# EAGLE design M868tqfp (EAGLE 6.6.0)
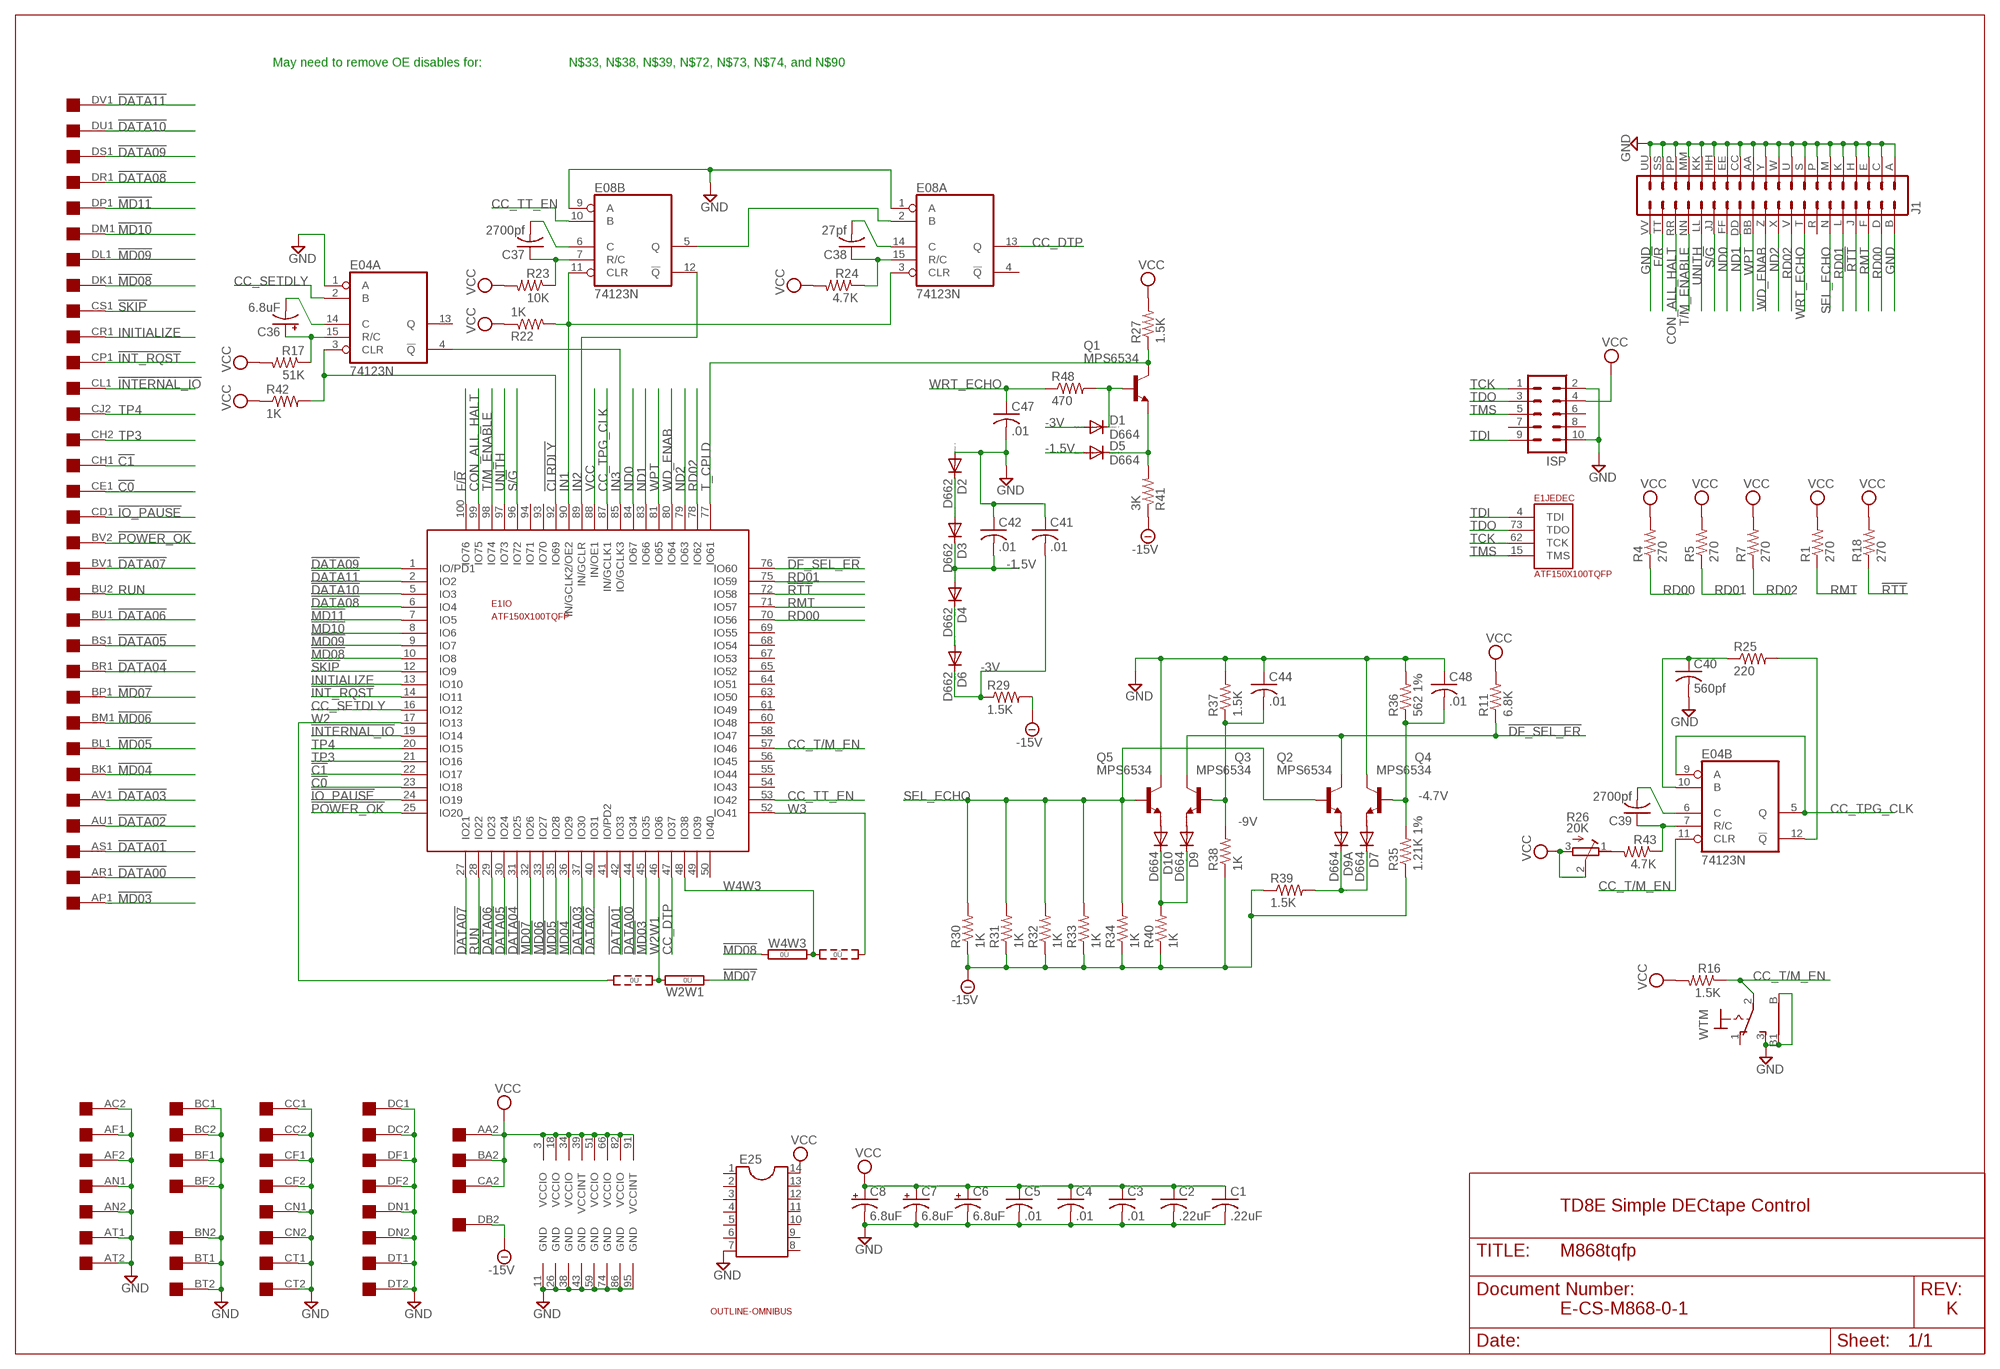
[diagram p0: schematic, sheet 1]

## Parts
C1  .22uF  C-US050-025X075  [C050-025X075]
C2  .22uF  C-US050-025X075  [C050-025X075]
C3  .01  C-US050-025X075  [C050-025X075]
C4  .01  C-US050-025X075  [C050-025X075]
C5  .01  C-US050-025X075  [C050-025X075]
C6  6.8uF  CPOL-USE20-8AXIAL  [E12-8]
C7  6.8uF  CPOL-USE20-8AXIAL  [E12-8]
C8  6.8uF  CPOL-USE20-8AXIAL  [E12-8]
C36  6.8uF  CPOL-USE20-8AXIAL  [E12-8]
C37  2700pf  C-US102-043X133  [C102-043X133]
C38  27pf  C-US050-025X075  [C050-025X075]
C39  2700pf  C-US102-043X133  [C102-043X133]
C40  560pf  C-US075-032X103  [C075-032X103]
C41  .01  C-US050-025X075  [C050-025X075]
C42  .01  C-US050-025X075  [C050-025X075]
C44  .01  C-US050-025X075  [C050-025X075]
C47  .01  C-US050-025X075  [C050-025X075]
C48  .01  C-US050-025X075  [C050-025X075]
D1  D664  1N4148DO35-10  [DO35-10]
D2  D662  1N4148DO35-10  [DO35-10]
D3  D662  1N4148DO35-10  [DO35-10]
D4  D662  1N4148DO35-10  [DO35-10]
D5  D664  1N4148DO35-10  [DO35-10]
D6  D662  1N4148DO35-10  [DO35-10]
D7  D664  1N4148DO35-10  [DO35-10]
D9  D664  1N4148DO35-10  [DO35-10]
D9A  D664  1N4148DO35-10  [DO35-10]
D10  D664  1N4148DO35-10  [DO35-10]
E1  ATF150X100TQFP  [TQFP-100]
E04  74123N  [DIL16]
E08  74123N  [DIL16]
E25  DIL14  [DIL14]
EDGE$3  QUAD  [EDGE-CON8]
ISP  ML10  [ML10]
J1  DEC40PINH  [DEC40PINH]
Q1  MPS6534  2N2219  [TO5]
Q2  MPS6534  2N2219  [TO5]
Q3  MPS6534  2N2219  [TO5]
Q4  MPS6534  2N2219  [TO5]
Q5  MPS6534  2N2219  [TO5]
R1  270  R-US_0207/10  [0207/10]
R4  270  R-US_0207/10  [0207/10]
R5  270  R-US_0207/10  [0207/10]
R7  270  R-US_0207/10  [0207/10]
R11  6.8K  R-US_0207/10  [0207/10]
R16  1.5K  R-US_0207/10  [0207/10]
R17  51K  R-US_0207/10  [0207/10]
R18  270  R-US_0207/10  [0207/10]
R22  1K  R-US_0207/10  [0207/10]
R23  10K  R-US_0207/10  [0207/10]
R24  4.7K  R-US_0207/10  [0207/10]
R25  220  R-US_0207/10  [0207/10]
R26  20K  275P  [3006Y]
R27  1.5K  R-US_0207/10  [0207/10]
R29  1.5K  R-US_0207/10  [0207/10]
R30  1K  R-US_0207/10  [0207/10]
R31  1K  R-US_0207/10  [0207/10]
R32  1K  R-US_0207/10  [0207/10]
R33  1K  R-US_0207/10  [0207/10]
R34  1K  R-US_0207/10  [0207/10]
R35  1.21K 1%  R-US_0207/15  [0207/15]
R36  562 1%  R-US_0207/15  [0207/15]
R37  1.5K  R-US_0207/10  [0207/10]
R38  1K  R-US_0207/10  [0207/10]
R39  1.5K  R-US_0207/10  [0207/10]
R40  1K  R-US_0207/10  [0207/10]
R41  3K  R-US_0207/10  [0207/10]
R42  1K  R-US_0207/10  [0207/10]
R43  4.7K  R-US_0207/10  [0207/10]
R48  470  R-US_0207/10  [0207/10]
U$1  OUTLINE-OMNIBUS  [OMNIBUS]
W2W1  0R2  [0R2/10]
W4W3  0R2  [0R2/10]
WTM  9070-1W  [9070-1W]

## Nets
!C0: E1.23(IO:IO18) EDGE$3.CE1
!C1: E1.22(IO:IO17) EDGE$3.CH1
!CC_TPG_CLK: C40.1 E04.10(B:B) R25.1
!CLRDLY: E1.92(IO:IO69) E04.3(A:CLR) R42.2
!DATA00: E1.44(IO:IO34) EDGE$3.AR1
!DATA01: E1.42(IO:IO33) EDGE$3.AS1
!DATA02: E1.40(IO:IO31) EDGE$3.AU1
!DATA03: E1.37(IO:IO30) EDGE$3.AV1
!DATA04: E1.31(IO:IO25) EDGE$3.BR1
!DATA05: E1.30(IO:IO24) EDGE$3.BS1
!DATA06: E1.29(IO:IO23) EDGE$3.BU1
!DATA07: E1.27(IO:IO21) EDGE$3.BV1
!DATA08: E1.6(IO:IO4) EDGE$3.DR1
!DATA09: E1.1(IO:IO/PD1) EDGE$3.DS1
!DATA10: E1.5(IO:IO3) EDGE$3.DU1
!DATA11: E1.2(IO:IO2) EDGE$3.DV1
!DF_SEL_ER: E1.76(IO:IO60) Q2.3(C) Q3.3(C) R11.1
!INT_RQST: E1.14(IO:IO11) EDGE$3.CP1
!INTERNAL_IO: E1.19(IO:IO14) EDGE$3.CL1
!IO_PAUSE: E1.24(IO:IO19) EDGE$3.CD1
!MD03: E1.45(IO:IO35) EDGE$3.AP1
!MD04: E1.36(IO:IO29) EDGE$3.BK1
!MD05: E1.35(IO:IO28) EDGE$3.BL1
!MD06: E1.33(IO:IO27) EDGE$3.BM1
!MD07: E1.32(IO:IO26) EDGE$3.BP1 W2W1.1
!MD08: E1.10(IO:IO8) EDGE$3.DK1 W4W3.1
!MD09: E1.9(IO:IO7) EDGE$3.DL1
!MD10: E1.8(IO:IO6) EDGE$3.DM1
!MD11: E1.7(IO:IO5) EDGE$3.DP1
!POWER_OK: E1.25(IO:IO20) EDGE$3.BV2
!RTT: E1.72(IO:IO58) J1.J R18.1
!SKIP: E1.12(IO:IO9) EDGE$3.CS1
-1.5V: C42.2 D3.C D4.A D5.A
-3V: C41.2 D1.A D6.C R29.1
-4.7V: C48.2 Q4.2(B) R35.2 R36.1
-9V: C44.2 Q3.2(B) R37.1 R38.2
-15V [supply]: EDGE$3.DB2 R29.2 R30.1 R31.1 R32.1 R33.1 R34.1 R35.1 R38.1 R39.1 R40.1 R41.1
CC_DTP: E1.47(IO:IO37) E08.13(A:Q)
CC_SETDLY: E1.16(IO:IO12) E04.2(A:B)
CC_T/M_EN: E1.57(IO:IO46) E04.11(B:CLR) R16.1 WTM.2(P)
CC_TPG_CLK: E1.87(IO:IN/GCLK1) E04.5(B:Q) E04.9(B:A)
CC_TT_EN: E1.53(IO:IO42) E08.10(B:B)
CON_ALL_HALT: E1.99(IO:IO75) J1.RR
F/!R: E1.100(IO:IO76) J1.TT
GND: C1.2 C2.2 C3.2 C4.2 C5.2 C6.- C7.- C8.- C40.2 C41.1 C42.1 C44.1 C47.2 C48.1 D2.A E1.11(GND) E1.26(GND) E1.38(GND) E1.43(GND) E1.59(GND) E1.74(GND) E1.86(GND) E1.95(GND) E04.1(A:A) E08.1(A:A) E08.9(B:A) E25.7 EDGE$3.AC2 EDGE$3.AF1 EDGE$3.AF2 EDGE$3.AN1 EDGE$3.AN2 EDGE$3.AT1 EDGE$3.AT2 EDGE$3.BC1 EDGE$3.BC2 EDGE$3.BF1 EDGE$3.BF2 EDGE$3.BN2 EDGE$3.BT1 EDGE$3.BT2 EDGE$3.CC1 EDGE$3.CC2 EDGE$3.CF1 EDGE$3.CF2 EDGE$3.CN1 EDGE$3.CN2 EDGE$3.CT1 EDGE$3.CT2 EDGE$3.DC1 EDGE$3.DC2 EDGE$3.DF1 EDGE$3.DF2 EDGE$3.DN1 EDGE$3.DN2 EDGE$3.DT1 EDGE$3.DT2 ISP.2 ISP.10 J1.A J1.AA J1.B J1.C J1.CC J1.E J1.EE J1.H J1.HH J1.K J1.KK J1.M J1.MM J1.P J1.PP J1.S J1.SS J1.U J1.UU J1.VV J1.W J1.Y Q4.3(C) Q5.3(C) R36.2 R37.2 WTM.3(S) WTM.B WTM.B1
IN1: E1.90(IO:IN/GCLK2/OE2) E08.3(A:CLR) E08.11(B:CLR) R22.2
IN2: E1.89(IO:IN/GCLR) E08.12(B:!Q)
IN3: E1.85(IO:IO/GCLK3) E04.4(A:!Q)
INITIALIZE: E1.13(IO:IO10) EDGE$3.CR1
N$51: D1.C Q1.2(B) R48.2
N$52: D5.C Q1.1(E) R41.2
N$54: D2.C D3.A
N$55: D9.C D10.C R40.2
N$56: D4.C D6.A
N$57: D10.A Q5.1(E)
N$58: D9.A Q3.1(E)
N$59: D9A.A Q2.1(E)
N$60: D7.A Q4.1(E)
N$63: D7.C D9A.C R39.2
N$77: E08.2(A:B) E08.5(B:Q)
N$78: C37.1 E08.7(B:R/C) R23.1
N$79: C38.1 E08.15(A:R/C) R24.1
N$81: C38.2 E08.14(A:C)
N$82: C37.2 E08.6(B:C)
N$94: C36.+ E04.15(A:R/C) R17.1
N$95: C36.- E04.14(A:C)
N$108: C39.1 E04.7(B:R/C) R43.1
N$110: C39.2 E04.6(B:C)
N$111: R26.1(A) R43.2
N$112: E04.12(B:!Q) R25.2
ND0: E1.84(IO:IO67) J1.FF
ND1: E1.83(IO:IO66) J1.DD
ND2: E1.79(IO:IO63) J1.X
RD00: E1.70(IO:IO56) J1.D R4.1
RD01: E1.75(IO:IO59) J1.L R5.1
RD02: E1.78(IO:IO62) J1.V R7.1
RMT: E1.71(IO:IO57) J1.F R1.1
RUN: E1.28(IO:IO22) EDGE$3.BU2
S/!G: E1.96(IO:IO72) J1.JJ
SEL_ECHO: J1.N Q2.2(B) Q5.2(B) R30.2 R31.2 R32.2 R33.2 R34.2
T/M_ENABLE: E1.98(IO:IO74) J1.NN
T_CPLD: E1.77(IO:IO61) Q1.3(C) R27.1
TCK: E1.62(JEDEC:TCK) ISP.1
TDI: E1.4(JEDEC:TDI) ISP.9
TDO: E1.73(JEDEC:TDO) ISP.3
TMS: E1.15(JEDEC:TMS) ISP.5
TP3: E1.21(IO:IO16) EDGE$3.CH2
TP4: E1.20(IO:IO15) EDGE$3.CJ2
UNITH: E1.97(IO:IO73) J1.LL
VCC [supply]: C1.1 C2.1 C3.1 C4.1 C5.1 C6.+ C7.+ C8.+ E1.3(VCCIO) E1.18(VCCIO) E1.34(VCCIO) E1.39(VCCINT) E1.51(VCCIO) E1.66(VCCIO) E1.82(VCCIO) E1.88(IO:IN/OE1) E1.91(VCCINT) E25.14 EDGE$3.AA2 EDGE$3.BA2 EDGE$3.CA2 ISP.4 R1.2 R4.2 R5.2 R7.2 R11.2 R16.2 R17.2 R18.2 R22.1 R23.2 R24.2 R26.2(S) R26.3(E) R27.2 R42.1
W2: E1.17(IO:IO13) W2W1.3
W2W1: E1.46(IO:IO36) W2W1.2
W3: E1.52(IO:IO41) W4W3.3
W4W3: E1.48(IO:IO38) W4W3.2
WD_ENAB: E1.80(IO:IO64) J1.Z
WPT: E1.81(IO:IO65) J1.BB
WRT_ECHO: C47.1 J1.T R48.1
Unconnected: E1.41(IO:IO/PD2) E1.49(IO:IO39) E1.50(IO:IO40) E1.54(IO:IO43) E1.55(IO:IO44) E1.56(IO:IO45) E1.58(IO:IO47) E1.60(IO:IO48) E1.61(IO:IO49) E1.63(IO:IO50) E1.64(IO:IO51) E1.65(IO:IO52) E1.67(IO:IO53) E1.68(IO:IO54) E1.69(IO:IO55) E1.93(IO:IO70) E1.94(IO:IO71) E04.13(A:Q) E08.4(A:!Q) E25.1 E25.2 E25.3 E25.4 E25.5 E25.6 E25.8 E25.9 E25.10 E25.11 E25.12 E25.13 EDGE$3.AA1 EDGE$3.AB1 EDGE$3.AB2 EDGE$3.AC1 EDGE$3.AD1 EDGE$3.AD2 EDGE$3.AE1 EDGE$3.AE2 EDGE$3.AH1 EDGE$3.AH2 EDGE$3.AJ1 EDGE$3.AJ2 EDGE$3.AK1 EDGE$3.AK2 EDGE$3.AL1 EDGE$3.AL2 EDGE$3.AM1 EDGE$3.AM2 EDGE$3.AP2 EDGE$3.AR2 EDGE$3.AS2 EDGE$3.AU2 EDGE$3.AV2 EDGE$3.BA1 EDGE$3.BB1 EDGE$3.BB2 EDGE$3.BD1 EDGE$3.BD2 EDGE$3.BE1 EDGE$3.BE2 EDGE$3.BH1 EDGE$3.BH2 EDGE$3.BJ1 EDGE$3.BJ2 EDGE$3.BK2 EDGE$3.BL2 EDGE$3.BM2 EDGE$3.BN1 EDGE$3.BP2 EDGE$3.BR2 EDGE$3.BS2 EDGE$3.CA1 EDGE$3.CB1 EDGE$3.CB2 EDGE$3.CD2 EDGE$3.CE2 EDGE$3.CJ1 EDGE$3.CK1 EDGE$3.CK2 EDGE$3.CL2 EDGE$3.CM1 EDGE$3.CM2 EDGE$3.CP2 EDGE$3.CR2 EDGE$3.CS2 EDGE$3.CU1 EDGE$3.CU2 EDGE$3.CV1 EDGE$3.CV2 EDGE$3.DA1 EDGE$3.DA2 EDGE$3.DB1 EDGE$3.DD1 EDGE$3.DD2 EDGE$3.DE1 EDGE$3.DE2 EDGE$3.DH1 EDGE$3.DH2 EDGE$3.DJ1 EDGE$3.DJ2 EDGE$3.DK2 EDGE$3.DL2 EDGE$3.DM2 EDGE$3.DP2 EDGE$3.DR2 EDGE$3.DS2 EDGE$3.DU2 EDGE$3.DV2 ISP.6 ISP.7 ISP.8 J1.R WTM.1(O)

## Notes on the sheet
- May need to remove OE disables for: | N$33, N$38, N$39, N$72, N$73, N$74, and N$90
- TD8E Simple DECtape Control
- E-CS-M868-0-1 | K

## Power pins joined to a net without a drawn wire
GND: E04.8(P:GND) E08.8(P:GND)
VCC: E04.16(P:VCC) E08.16(P:VCC)

## Library data of the parts
C1-C5 C37-C42 C44 C47 C48 = rcl:C-US: CAPACITOR, American symbol
C6-C8 C36 = dec-con:CPOL-USE20-8AXIAL: A 0.8 inch electrolytic.
D1-D7 D9 D9A D10 = diode:1N4148: DIODE high speed (Philips)
E1 = atmel-cpld:ATF150X100: ATF150x in 100 pin package.
E04 E08 = 74xx-us:74*123: Retriggerable monostable MULTIVIBRATOR
E25 = ic-package:DIL14: Dual In Line / Socket
EDGE$3 = dec-con:QUAD: Quad-Height DEC board
ISP = con-harting-ml:ML10: HARTING; OC_FARNELL: unknown; OC_NEWARK: unknown
J1 = dec-con:DEC40PIN: PIN HEADER
Q1-Q5 = transistor-npn:2N2219: NPN Transistor
R1 R4 R5 R7 R11 R16-R18 R22-R25 R27 R29-R43 R48 = rcl:R-US_: RESISTOR, American symbol
R26 = dec-con:275P: Trimpot with 275P (3006Y) footprint.
U$1 = dec-con:OUTLINE-*: Board outlines for DEC boards.
W2W1 W4W3 = jumper:0R2: Bridge switch 0R 2 x 10mm
WTM = switch:9070-1W: TOGGLE SWITCH Marquardt

## Board
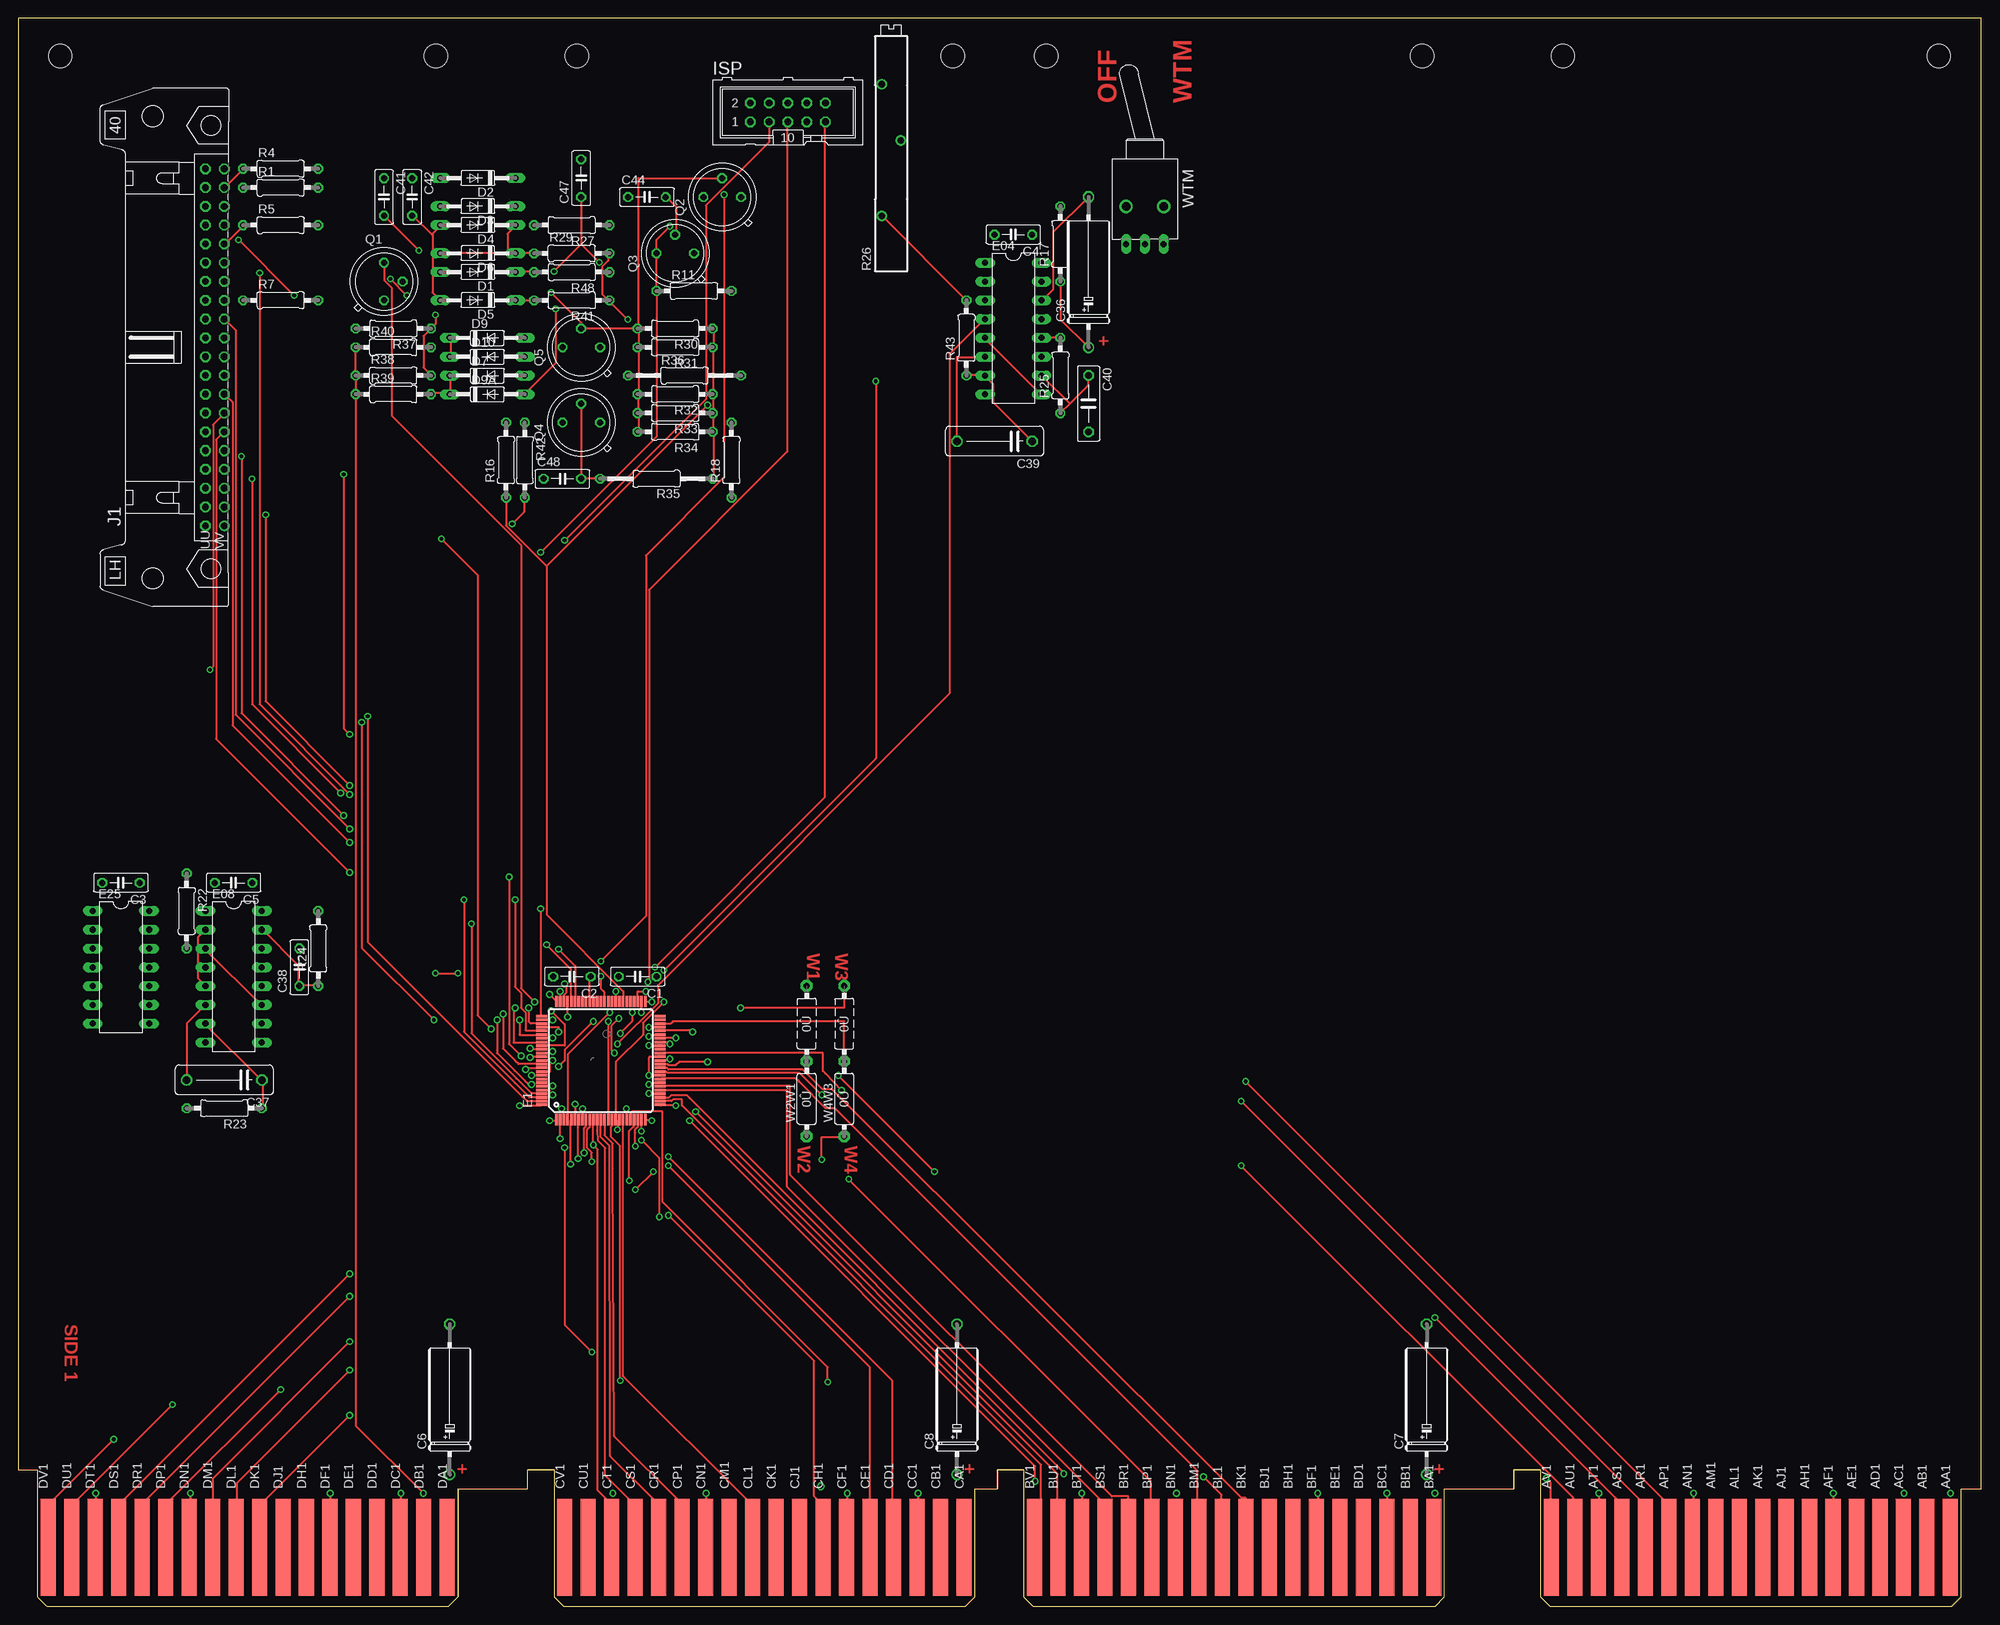
[diagram p1: board, top side]
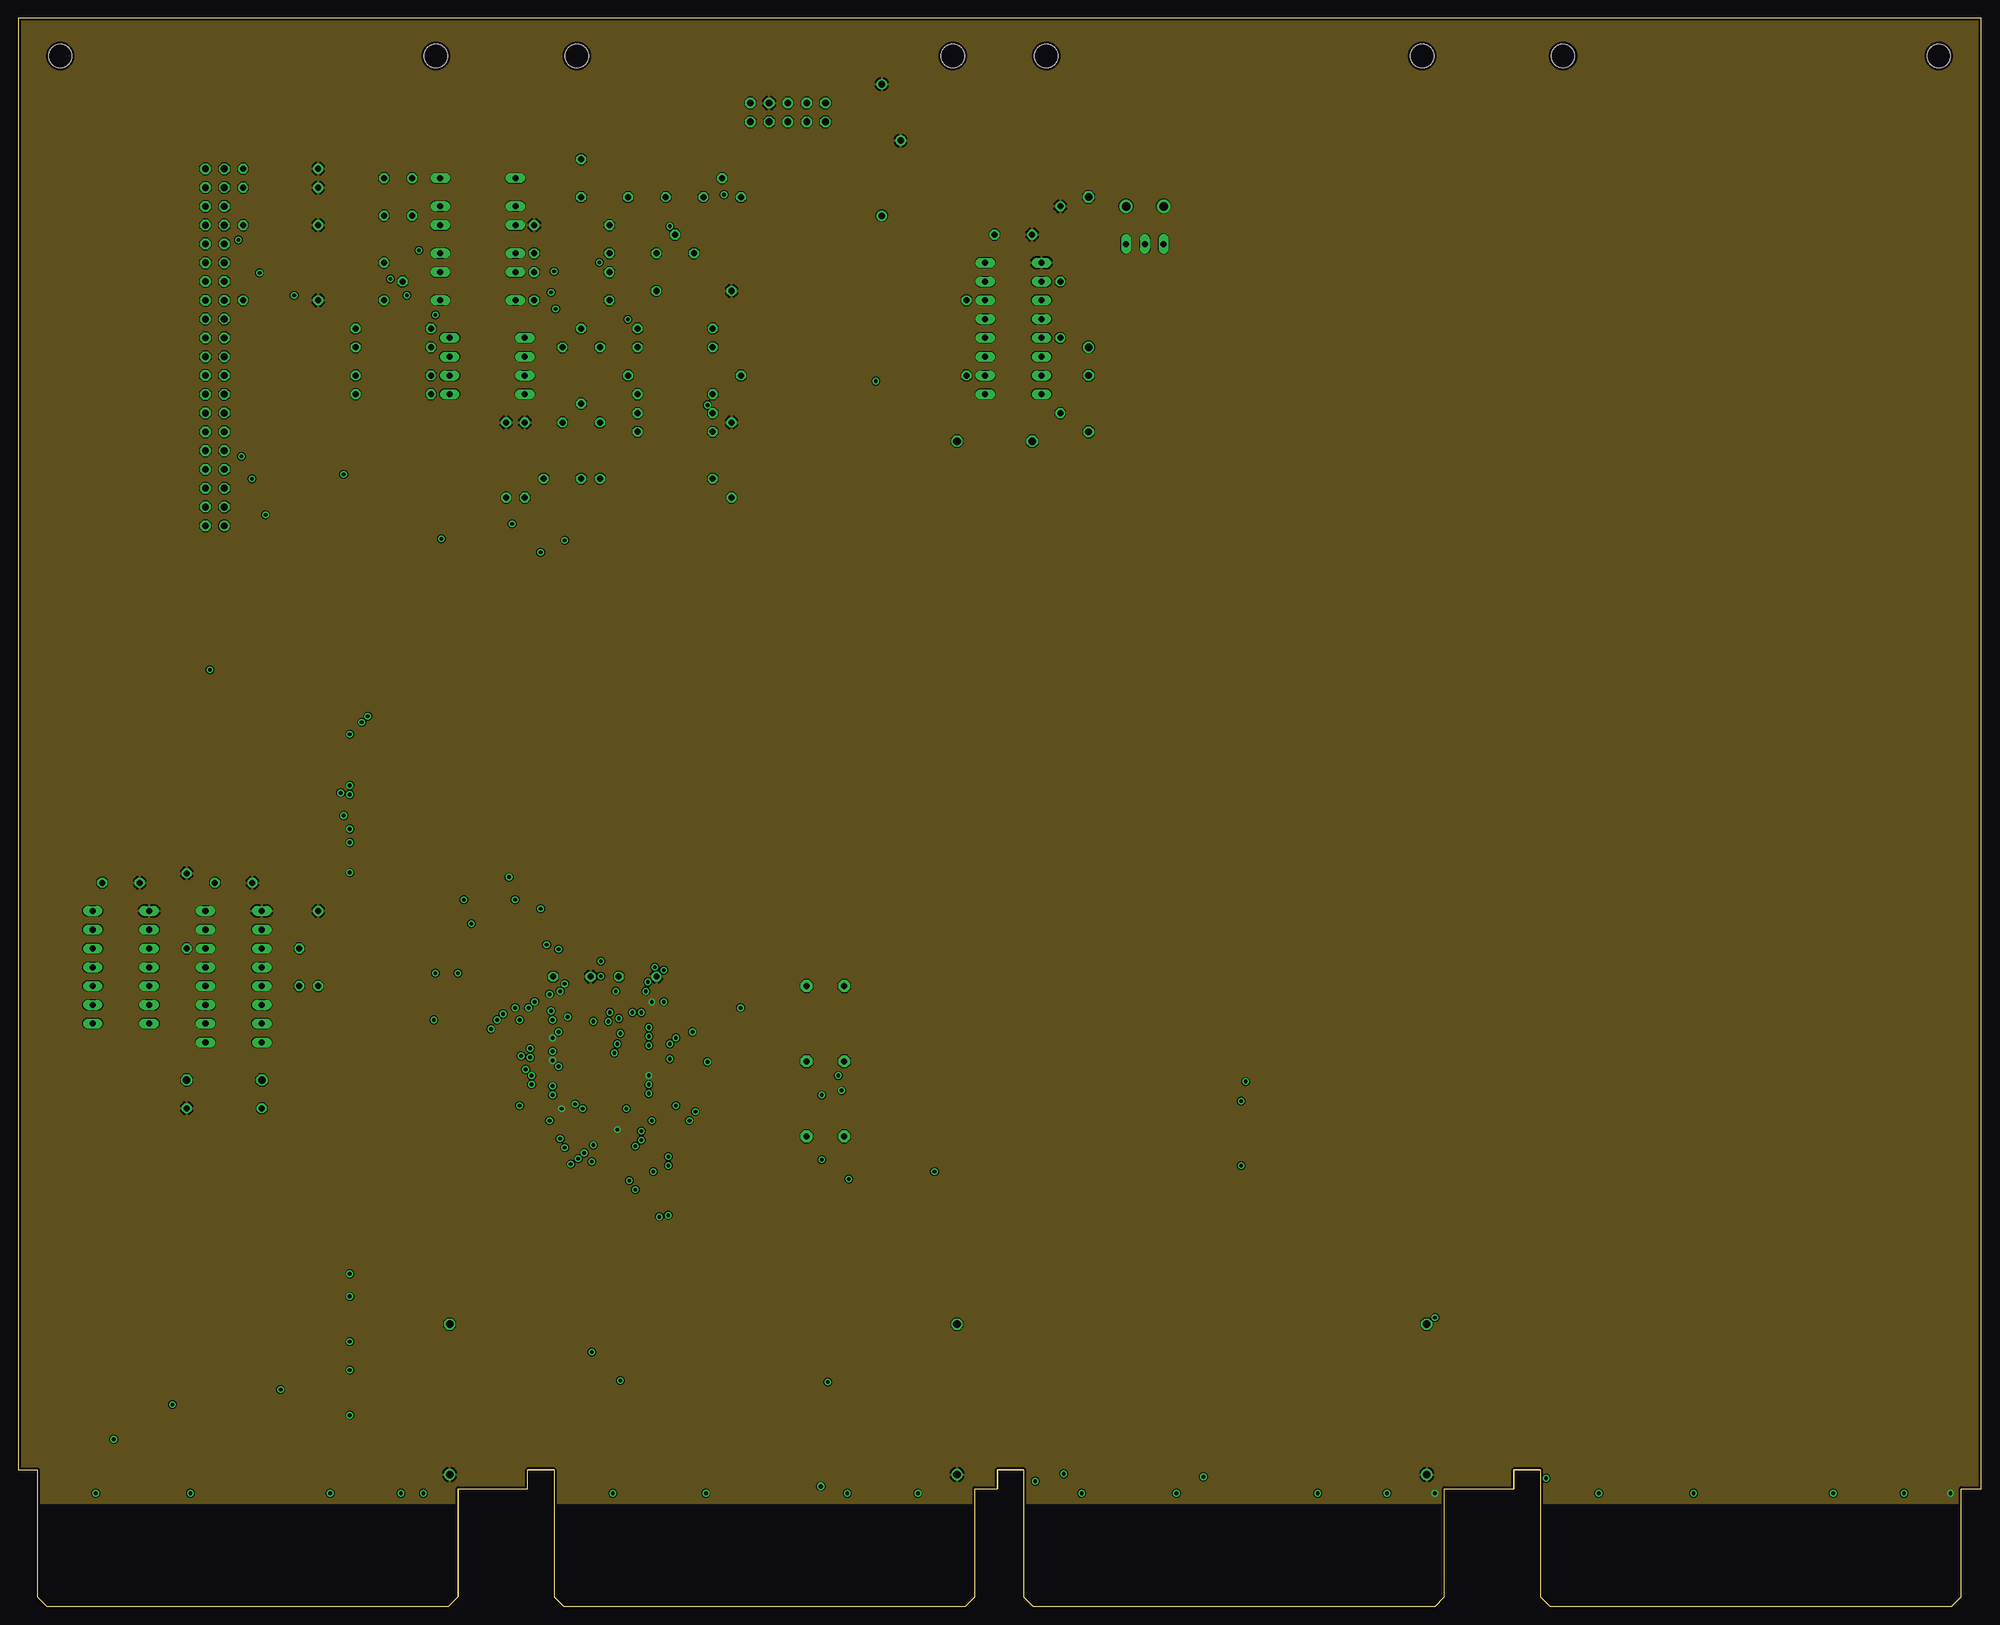
[diagram p2: board, inner layer VCC$]
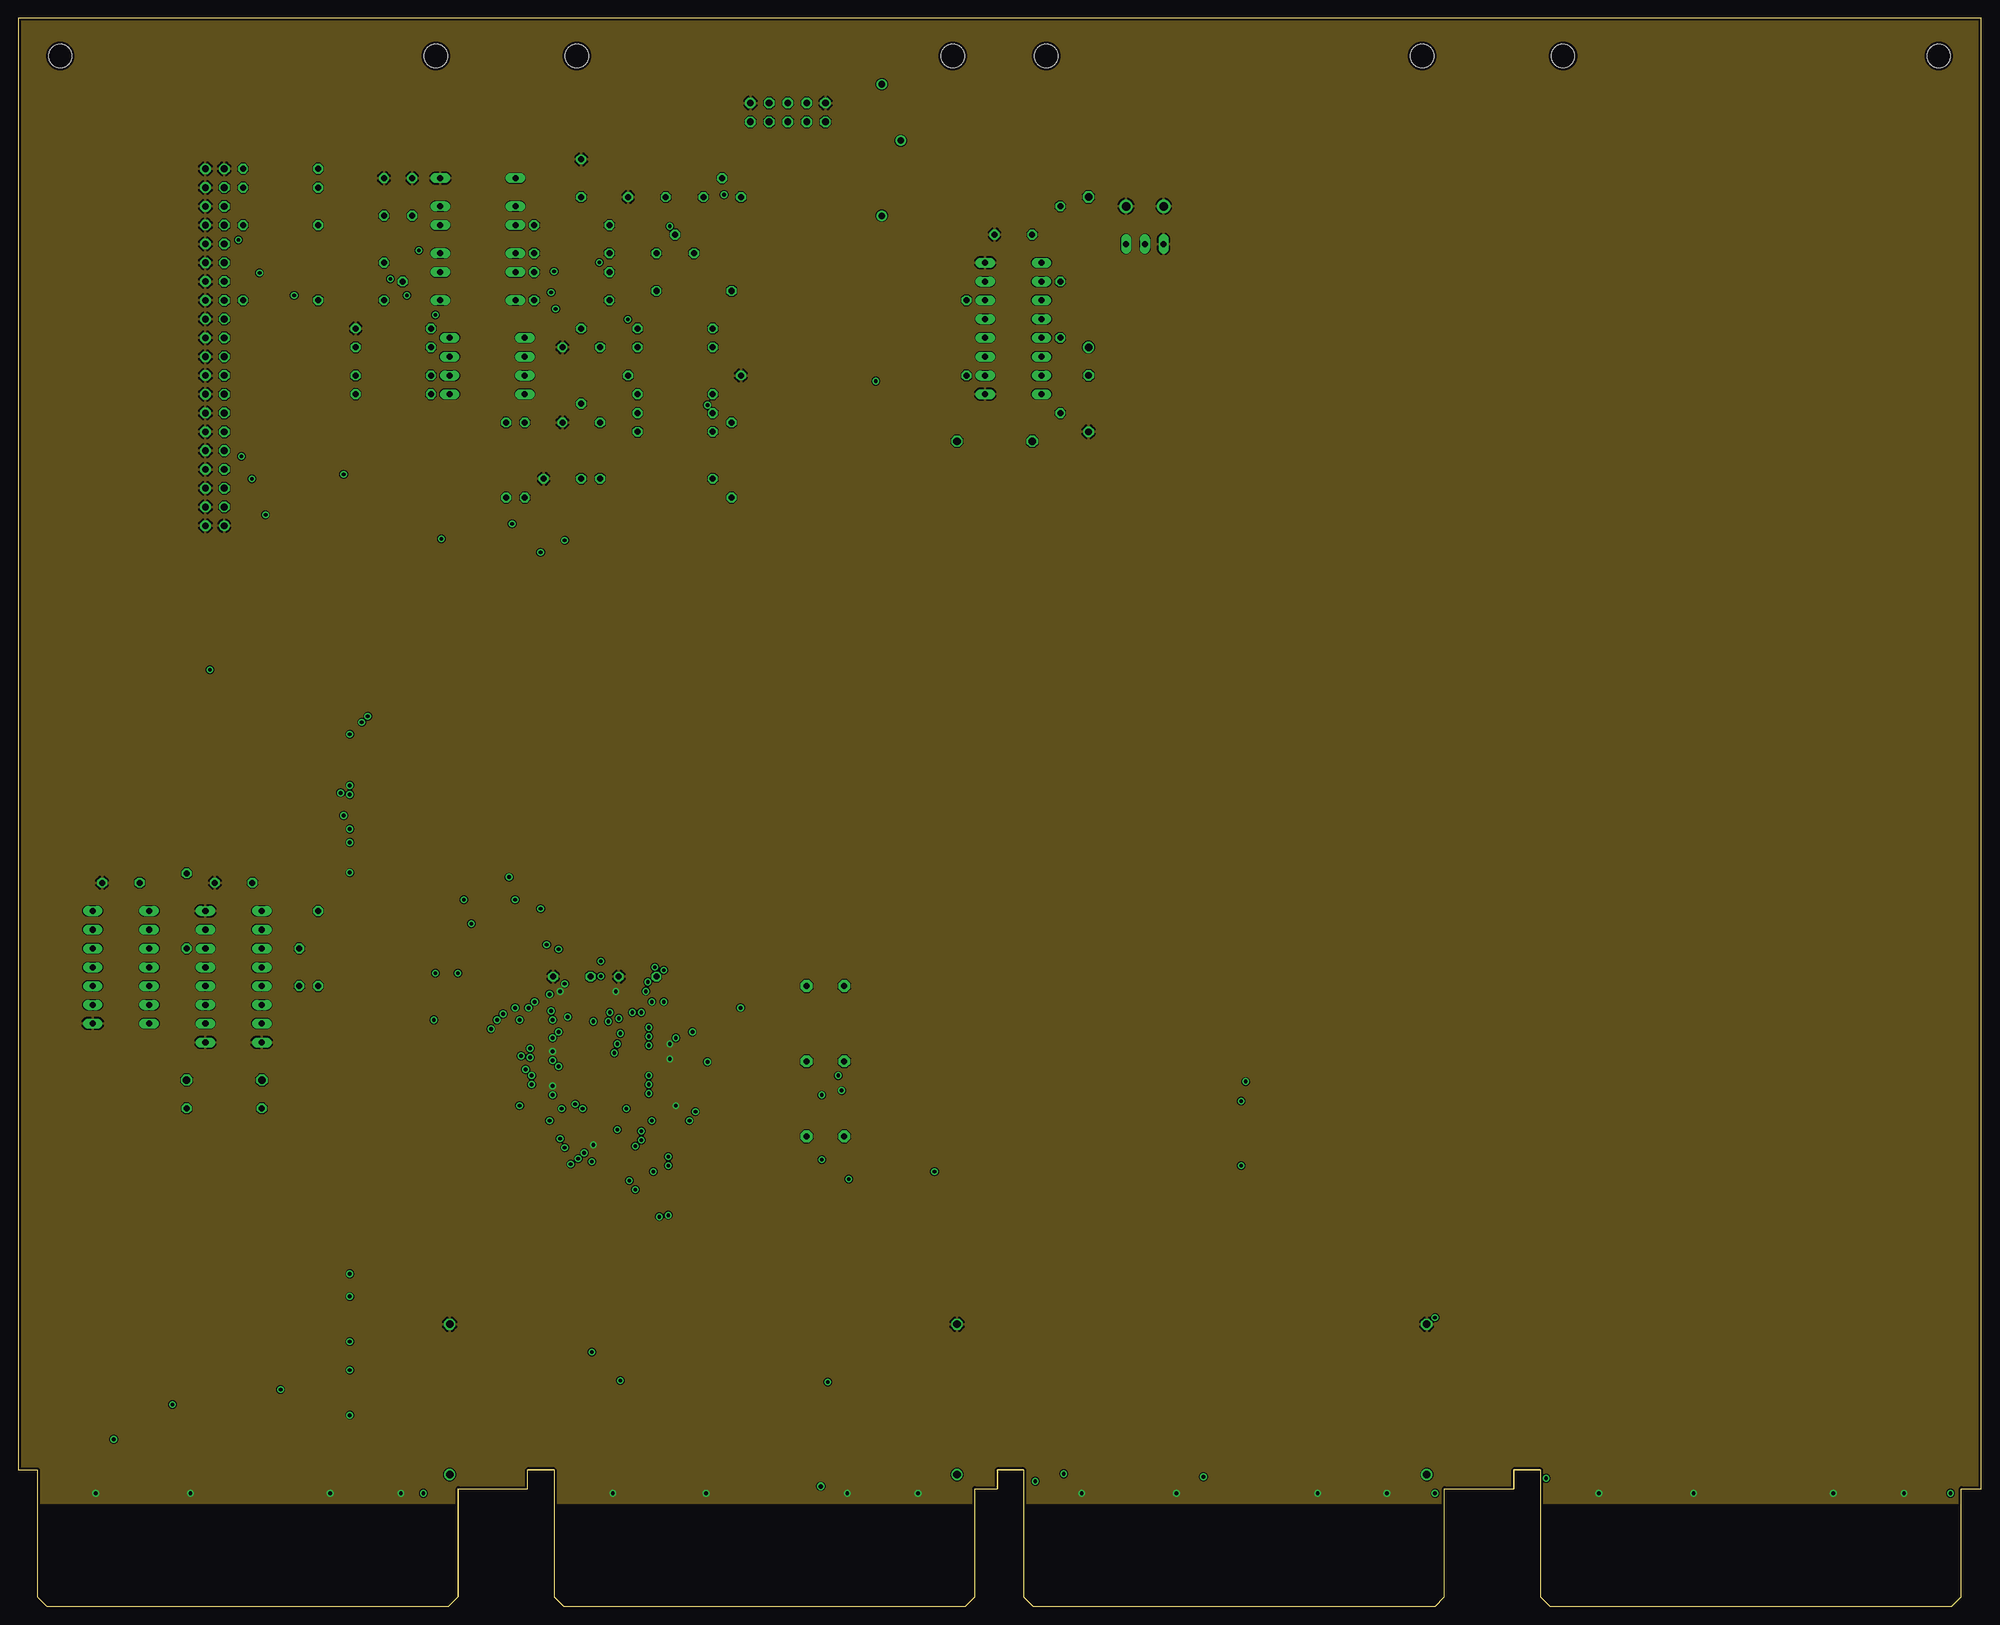
[diagram p3: board, inner layer GND$]
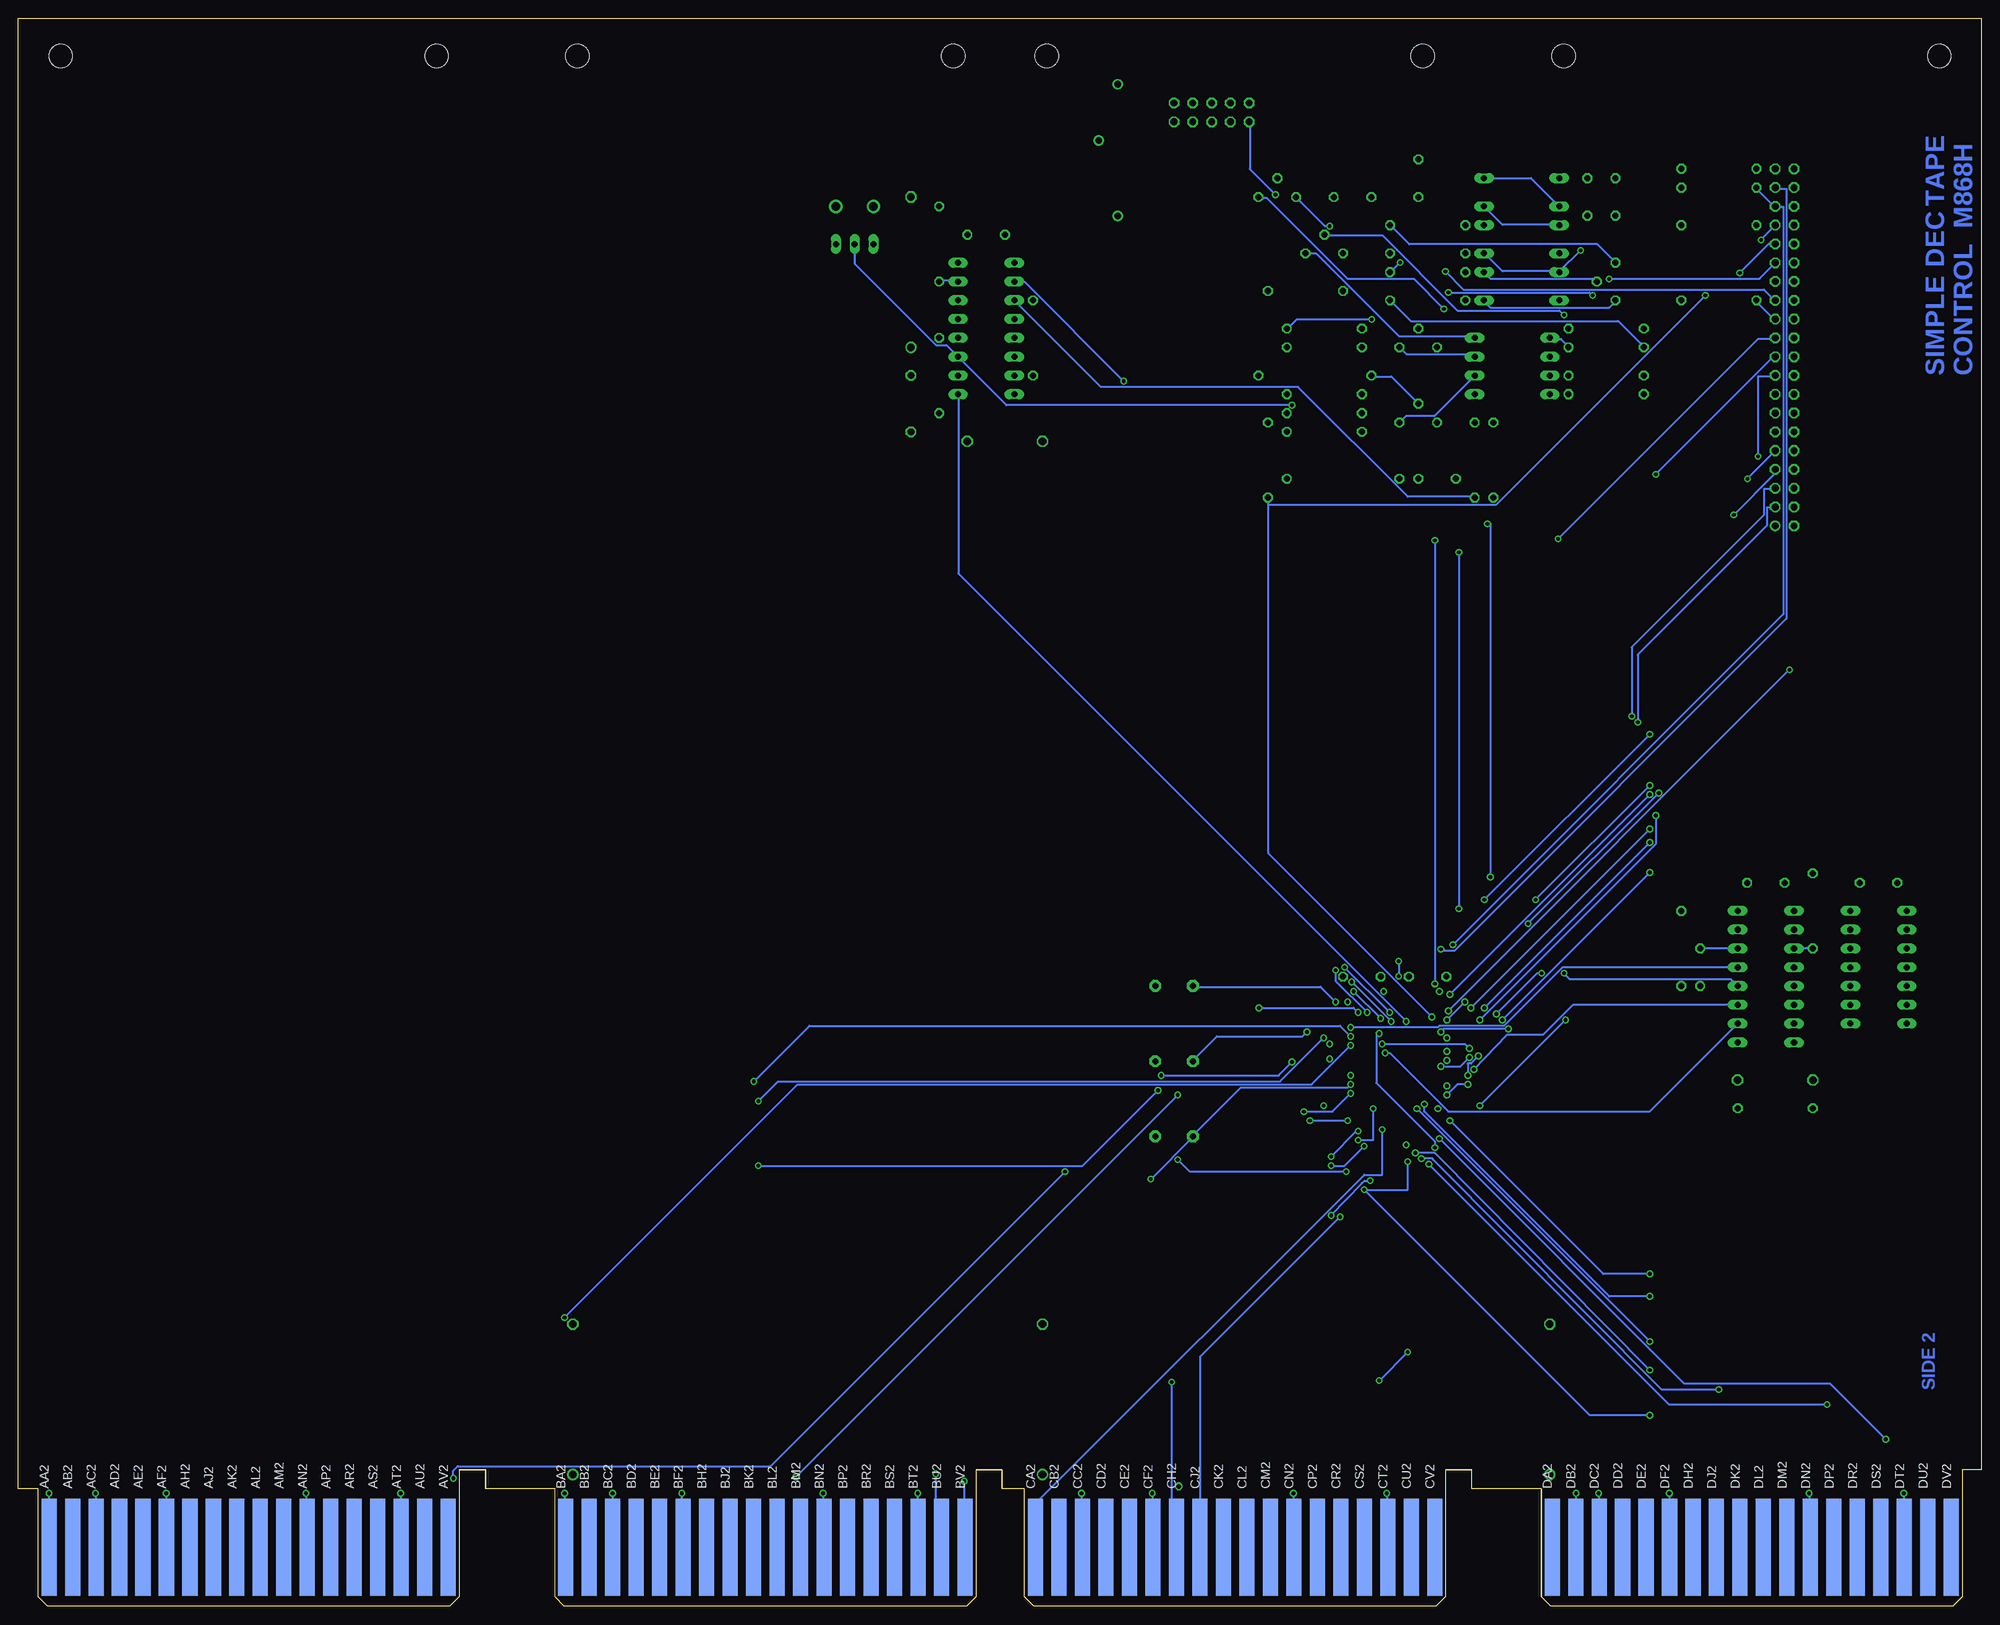
[diagram p4: board, bottom side, seen from below]

Size 265.3 x 214.63 mm. Coordinates in mm from the lower left corner, seen from the top.
Copper layers (1+2+3+16): Top 0.035mm / dielectric 1.5mm / VCC$ 0.035mm / dielectric 0.15mm / GND$ 0.035mm / dielectric 0.2mm / Bottom 0.035mm
Design rules "pld *": minimum track width 10mil, minimum drill 20mil, track to track 5mil, track to pad 5mil, pad to pad 5mil, via to via 5mil, smd to smd 5mil, copper to edge 13mil, drill to drill 10mil, minimum pad ring 10mil, minimum via ring 8mil, stop-mask expansion 0mil, vias tented up to drill 0mil, thermal gap 10mil

### Footprints (pad centres in the part's own frame; a part is rotated, then mirrored left to right if it is on the bottom)
C050-025X075 = drill 0.813 octagon: 1 -2.54,0; 2 2.54,0
E12-8 = drill 1.016: + -10.16,0 | drill 1.016 octagon: - 10.16,0
C102-043X133 = drill 1.016 octagon: 1 -5.08,0; 2 5.08,0
C075-032X103 = drill 0.914 octagon: 1 -3.81,0; 2 3.81,0
DO35-10 = drill 0.813 long: A 5.08,0; C -5.08,0
TQFP-100 = smd 1.5 x 0.35: 1 -8,6; 2 -8,5.5; 3 -8,5; 4 -8,4.5; 5 -8,4; 6 -8,3.5; 7 -8,3; 8 -8,2.5; 9 -8,2; 10 -8,1.5; 11 -8,1; 12 -8,0.5; 13 -8,0; 14 -8,-0.5; 15 -8,-1; 16 -8,-1.5; 17 -8,-2; 18 -8,-2.5; 19 -8,-3; 20 -8,-3.5; 21 -8,-4; 22 -8,-4.5; 23 -8,-5; 24 -8,-5.5; 25 -8,-6; 51 8,-6; 52 8,-5.5; 53 8,-5; 54 8,-4.5; 55 8,-4; 56 8,-3.5; 57 8,-3; 58 8,-2.5; 59 8,-2; 60 8,-1.5; 61 8,-1; 62 8,-0.5; 63 8,0; 64 8,0.5; 65 8,1; 66 8,1.5; 67 8,2; 68 8,2.5; 69 8,3; 70 8,3.5; 71 8,4; 72 8,4.5; 73 8,5; 74 8,5.5; 75 8,6 | smd 0.35 x 1.5: 26 -6,-8; 27 -5.5,-8; 28 -5,-8; 29 -4.5,-8; 30 -4,-8; 31 -3.5,-8; 32 -3,-8; 33 -2.5,-8; 34 -2,-8; 35 -1.5,-8; 36 -1,-8; 37 -0.5,-8; 38 0,-8; 39 0.5,-8; 40 1,-8; 41 1.5,-8; 42 2,-8; 43 2.5,-8; 44 3,-8; 45 3.5,-8; 46 4,-8; 47 4.5,-8; 48 5,-8; 49 5.5,-8; 50 6,-8; 76 6,8; 77 5.5,8; 78 5,8; 79 4.5,8; 80 4,8; 81 3.5,8; 82 3,8; 83 2.5,8; 84 2,8; 85 1.5,8; 86 1,8; 87 0.5,8; 88 0,8; 89 -0.5,8; 90 -1,8; 91 -1.5,8; 92 -2,8; 93 -2.5,8; 94 -3,8; 95 -3.5,8; 96 -4,8; 97 -4.5,8; 98 -5,8; 99 -5.5,8; 100 -6,8
DIL16 = drill 0.813 long: 1 -8.89,-3.81; 2 -6.35,-3.81; 3 -3.81,-3.81; 4 -1.27,-3.81; 5 1.27,-3.81; 6 3.81,-3.81; 7 6.35,-3.81; 8 8.89,-3.81; 9 8.89,3.81; 10 6.35,3.81; 11 3.81,3.81; 12 1.27,3.81; 13 -1.27,3.81; 14 -3.81,3.81; 15 -6.35,3.81; 16 -8.89,3.81
DIL14 = drill 0.813 long: 1 -7.62,-3.81; 2 -5.08,-3.81; 3 -2.54,-3.81; 4 0,-3.81; 5 2.54,-3.81; 6 5.08,-3.81; 7 7.62,-3.81; 8 7.62,3.81; 9 5.08,3.81; 10 2.54,3.81; 11 0,3.81; 12 -2.54,3.81; 13 -5.08,3.81; 14 -7.62,3.81
EDGE-CON8 = smd 2.032 x 13.106: AA1 261.303,7.938; AB1 258.127,7.938; AC1 254.952,7.938; AD1 251.778,7.938; AE1 248.602,7.938; AF1 245.428,7.938; AH1 242.252,7.938; AJ1 239.077,7.938; AK1 235.903,7.938; AL1 232.727,7.938; AM1 229.553,7.938; AN1 226.377,7.938; AP1 223.202,7.938; AR1 220.028,7.938; AS1 216.852,7.938; AT1 213.678,7.938; AU1 210.502,7.938; AV1 207.327,7.938; BA1 191.452,7.938; BB1 188.278,7.938; BC1 185.102,7.938; BD1 181.928,7.938; BE1 178.752,7.938; BF1 175.577,7.938; BH1 172.403,7.938; BJ1 169.227,7.938; BK1 166.053,7.938; BL1 162.877,7.938; BM1 159.702,7.938; BN1 156.528,7.938; BP1 153.352,7.938; BR1 150.178,7.938; BS1 147.002,7.938; BT1 143.827,7.938; BU1 140.653,7.938; BV1 137.477,7.938; CA1 127.953,7.938; CB1 124.778,7.938; CC1 121.603,7.938; CD1 118.427,7.938; CE1 115.252,7.938; CF1 112.078,7.938; CH1 108.903,7.938; CJ1 105.728,7.938; CK1 102.552,7.938; CL1 99.377,7.938; CM1 96.203,7.938; CN1 93.028,7.938; CP1 89.853,7.938; CR1 86.677,7.938; CS1 83.502,7.938; CT1 80.328,7.938; CU1 77.153,7.938; CV1 73.978,7.938; DA1 58.102,7.938; DB1 54.928,7.938; DC1 51.752,7.938; DD1 48.578,7.938; DE1 45.403,7.938; DF1 42.227,7.938; DH1 39.053,7.938; DJ1 35.877,7.938; DK1 32.703,7.938; DL1 29.527,7.938; DM1 26.352,7.938; DN1 23.177,7.938; DP1 20.003,7.938; DR1 16.828,7.938; DS1 13.652,7.938; DT1 10.477,7.938; DU1 7.303,7.938; DV1 4.128,7.938 | smd 2.032 x 13.106 bottom: AA2 261.303,7.938; AB2 258.127,7.938; AC2 254.952,7.938; AD2 251.778,7.938; AE2 248.602,7.938; AF2 245.428,7.938; AH2 242.252,7.938; AJ2 239.077,7.938; AK2 235.903,7.938; AL2 232.727,7.938; AM2 229.553,7.938; AN2 226.377,7.938; AP2 223.202,7.938; AR2 220.028,7.938; AS2 216.852,7.938; AT2 213.678,7.938; AU2 210.502,7.938; AV2 207.327,7.938; BA2 191.452,7.938; BB2 188.278,7.938; BC2 185.102,7.938; BD2 181.928,7.938; BE2 178.752,7.938; BF2 175.577,7.938; BH2 172.403,7.938; BJ2 169.227,7.938; BK2 166.053,7.938; BL2 162.877,7.938; BM2 159.702,7.938; BN2 156.528,7.938; BP2 153.352,7.938; BR2 150.178,7.938; BS2 147.002,7.938; BT2 143.827,7.938; BU2 140.653,7.938; BV2 137.477,7.938; CA2 127.953,7.938; CB2 124.778,7.938; CC2 121.603,7.938; CD2 118.427,7.938; CE2 115.252,7.938; CF2 112.078,7.938; CH2 108.903,7.938; CJ2 105.728,7.938; CK2 102.552,7.938; CL2 99.377,7.938; CM2 96.203,7.938; CN2 93.028,7.938; CP2 89.853,7.938; CR2 86.677,7.938; CS2 83.502,7.938; CT2 80.328,7.938; CU2 77.153,7.938; CV2 73.978,7.938; DA2 58.102,7.938; DB2 54.928,7.938; DC2 51.752,7.938; DD2 48.578,7.938; DE2 45.403,7.938; DF2 42.227,7.938; DH2 39.053,7.938; DJ2 35.877,7.938; DK2 32.703,7.938; DL2 29.527,7.938; DM2 26.352,7.938; DN2 23.177,7.938; DP2 20.003,7.938; DR2 16.828,7.938; DS2 13.652,7.938; DT2 10.477,7.938; DU2 7.303,7.938; DV2 4.128,7.938
ML10 = drill 0.914 octagon: 1 -5.08,-1.27; 2 -5.08,1.27; 3 -2.54,-1.27; 4 -2.54,1.27; 5 0,-1.27; 6 0,1.27; 7 2.54,-1.27; 8 2.54,1.27; 9 5.08,-1.27; 10 5.08,1.27
DEC40PINH = drill 0.914 octagon: A 24.13,1.27; AA -3.81,1.27; B 24.13,-1.27; BB -3.81,-1.27; C 21.59,1.27; CC -6.35,1.27; D 21.59,-1.27; DD -6.35,-1.27; E 19.05,1.27; EE -8.89,1.27; F 19.05,-1.27; FF -8.89,-1.27; H 16.51,1.27; HH -11.43,1.27; J 16.51,-1.27; JJ -11.43,-1.27; K 13.97,1.27; KK -13.97,1.27; L 13.97,-1.27; LL -13.97,-1.27; M 11.43,1.27; MM -16.51,1.27; N 11.43,-1.27; NN -16.51,-1.27; P 8.89,1.27; PP -19.05,1.27; R 8.89,-1.27; RR -19.05,-1.27; S 6.35,1.27; SS -21.59,1.27; T 6.35,-1.27; TT -21.59,-1.27; U 3.81,1.27; UU -24.13,1.27; V 3.81,-1.27; W 1.27,1.27; X 1.27,-1.27; Y -1.27,1.27; Z -1.27,-1.27 | drill 0.914: VV -24.13,-1.27
TO5 = drill 0.813 octagon: 1 0,-2.54; 2 2.54,0; 3 0,2.54
0207/10 = drill 0.813 octagon: 1 -5.08,0; 2 5.08,0
3006Y = drill 0.9: 1 -8.89,1.27; 2 1.27,-1.27; 3 8.89,1.27
0207/15 = drill 0.813 octagon: 1 -7.62,0; 2 7.62,0
OMNIBUS = hole 3.175: 208.915,209.55; 259.715,209.55; 189.865,209.55; 139.065,209.55; 75.616,209.55; 126.416,209.55; 56.566,209.55; 5.766,209.55
0R2/10 = drill 0.813 pad 1.6 octagon: 1 -5.08,0; 2 5.08,0; 3 15.24,0
9070-1W = drill 0.813 long: 1 5.08,-2.54; 2 5.08,0; 3 5.08,2.54 | drill 1.118 pad 1.778: B 0,-2.54; B1 0,2.54

### Placement (x,y rotation side)
C1  83.69,85.09 180 top
C2  74.8,85.09 180 top
C3  13.84,97.79 180 top
C4  134.49,185.42 180 top
C5  29.08,97.79 180 top
C6  58.29,27.94 90 top
C7  190.37,27.94 90 top
C8  126.87,27.94 90 top
C36  144.65,180.34 90 top
C37  27.81,71.12 180 top
C38  37.97,86.36 90 top
C39  131.95,157.48 180 top
C40  144.65,162.56 270 top
C41  49.4,190.5 270 top
C42  53.21,190.5 270 top
C44  84.96,190.5 0 top
C47  76.07,193.04 90 top
C48  73.53,152.4 0 top
D1  62.1,180.34 180 top
D2  62.1,193.04 180 top
D3  62.1,189.23 180 top
D4  62.1,186.69 180 top
D5  62.1,176.53 180 top
D6  62.1,182.88 180 top
D7  63.37,166.37 0 top
D9  63.37,171.45 0 top
D9A  63.37,163.83 0 top
D10  63.37,168.91 0 top
E1  78.71,73.76 90 top
E04  134.49,172.72 270 top
E08  29.08,85.09 270 top
E25  13.84,86.36 270 top
EDGE$3  -0.13,0 0 top
ISP  104.01,201.93 0 top
J1  26.54,170.18 90 top
Q1  49.4,179.07 0 top
Q2  95.12,190.5 90 top
Q3  88.77,182.88 90 top
Q4  76.07,160.02 90 top
Q5  76.07,170.18 90 top
R1  35.43,191.77 0 top
R4  35.43,194.31 0 top
R5  35.43,186.69 0 top
R7  35.43,176.53 0 top
R11  91.31,177.8 0 top
R16  65.91,154.94 90 top
R17  140.84,184.15 90 top
R18  96.39,154.94 90 top
R22  22.73,93.98 270 top
R23  27.81,67.31 180 top
R24  40.51,88.9 90 top
R25  140.84,166.37 90 top
R26  117.98,196.85 90 top
R27  74.8,186.69 180 top
R29  74.8,182.88 0 top
R30  88.77,172.72 180 top
R31  88.77,170.18 180 top
R32  88.77,163.83 180 top
R33  88.77,161.29 180 top
R34  88.77,158.75 180 top
R35  86.23,152.4 180 top
R36  90.04,166.37 0 top
R37  50.67,172.72 180 top
R38  50.67,166.37 0 top
R39  50.67,163.83 0 top
R40  50.67,170.18 0 top
R41  74.8,176.53 180 top
R42  68.45,154.94 270 top
R43  128.14,171.45 90 top
R48  74.8,180.34 180 top
U$1  -0.13,0 0 top
W2W1  106.55,68.58 90 top
W4W3  111.63,68.58 90 top
WTM  152.27,189.23 270 top

### Tracks (layer width: path | path; a pad name or v marks a point on that pad's centre or on a via)
!C0  (via drill 0.51)
  Top 0.254: E1.23 83.72,64.74 83.39,64.41 83.39,64.01 v83.39,62.18 | v87.86,59.54 115.09,32.31 115.09,8.13 EDGE$3.CE1
  Bottom 0.254: v83.39,62.18 86.03,59.54 v87.86,59.54
!C1  (via drill 0.51)
  Top 0.254: v82.58,57.51 82.58,64.21 83.19,64.82 83.19,65.63 E1.22 | v87.86,52.83 107.57,33.12 107.57,14.83 108.59,13.82 108.59,8.13 EDGE$3.CH1
  Bottom 0.254: v87.86,52.83 83.69,57.15 83.34,57.51 v82.58,57.51
!CC_TPG_CLK
  Top 0.254: 142.11,162.56 144.55,165 144.55,166.22 C40.1 | 142.11,162.56 140.89,161.34 R25.1 | 142.11,162.56 138.45,166.22 E04.10
!CLRDLY  (via drill 0.51)
  Top 0.254: v69.37,71.73 70.59,71.73 E1.92 | v67.95,74.37 66.32,76 v66.32,98.55 | v66.73,146.3 68.35,147.93 68.35,149.76 R42.2
  Bottom 0.254: E04.3 130.53,176.38 118.95,164.79 92.33,164.79 77.5,149.96 68.56,149.96 R42.2 | v69.37,71.73 69.37,73.36 68.96,73.36 v67.95,74.37 | v66.32,98.55 66.32,146.3 v66.73,146.3
!DATA00  (via drill 0.51)
  Top 0.254: v88.88,76.81 86.84,76.81 E1.44 | v165.28,68.28 219.73,13.82 219.73,8.13 EDGE$3.AR1
  Bottom 0.254: v88.88,76.81 94.77,70.92 162.64,70.92 v165.28,68.28
!DATA01  (via drill 0.51)
  Top 0.254: v85.22,75.79 86.64,75.79 E1.42 | v191.49,39.01 216.69,13.82 216.69,8.13 EDGE$3.AS1
  Bottom 0.254: v85.22,75.79 90.5,70.51 160,70.51 v191.49,39.01
!DATA02  (via drill 0.51)
  Top 0.254: v111.28,69.7 109.09,71.98 108.74,72.34 108.74,74.78 86.84,74.78 E1.40 | v165.28,59.54 210.19,14.63 210.19,8.13 EDGE$3.AU1
  Bottom 0.254: v111.28,69.7 121.44,59.54 v165.28,59.54
!DATA03  (via drill 0.51)
  Top 0.254: E1.37 87.75,73.26 87.86,73.15 88.88,73.15 88.98,73.26 89.28,73.56 v93.14,73.56 | v123.83,58.73 v110.82,71.73 | v206.53,17.27 207.14,16.66 207.14,8.13 EDGE$3.AV1
  Bottom 0.254: v93.14,73.56 94.97,71.73 v110.82,71.73 | v123.83,58.73 163.65,18.9 205.92,18.9 206.53,18.29 v206.53,17.27
!DATA04
  Top 0.254: E1.31 86.84,70.31 104.32,70.31 104.32,58.32 147.8,14.83 150.04,14.83 150.04,8.13 EDGE$3.BR1
!DATA05
  Top 0.254: E1.30 86.84,69.7 103.91,69.7 103.91,56.69 146.79,13.82 146.79,8.13 EDGE$3.BS1
!DATA06  (via drill 0.51)
  Top 0.254: v85.22,69.29 86.64,69.29 E1.29 | v91.52,66.85 140.49,17.88 140.49,8.13 EDGE$3.BU1
  Bottom 0.254: v85.22,69.29 87.66,66.85 v91.52,66.85
!DATA07
  Top 0.254: E1.27 86.84,68.28 88.27,68.28 88.47,68.48 89.69,68.48 89.69,67.67 138.25,19.1 138.25,8.94 137.44,8.13 EDGE$3.BV1
!DATA08  (via drill 0.51)
  Top 0.254: v75.26,67.87 75.26,65.84 E1.6 | v44.78,41.86 16.74,13.82 16.74,8.13 EDGE$3.DR1
  Bottom 0.254: v75.26,67.87 75.26,66.85 50.27,41.86 v44.78,41.86
!DATA09  (via drill 0.51)
  Top 0.254: v71.81,65.63 72.62,65.63 E1.1 | v44.78,44.91 13.69,13.82 13.69,8.13 EDGE$3.DS1
  Bottom 0.254: v71.81,65.63 51.08,44.91 v44.78,44.91
!DATA10  (via drill 0.51)
  Top 0.254: v74.65,59.74 74.65,65.63 E1.5 | v20.8,27.23 7.19,13.61 7.19,8.13 EDGE$3.DU1
  Bottom 0.254: v74.65,59.74 42.14,27.23 v20.8,27.23
!DATA11  (via drill 0.51)
  Top 0.254: v73.23,63.2 73.23,65.63 E1.2 | v12.88,22.55 4.14,13.82 4.14,8.13 EDGE$3.DV1
  Bottom 0.254: v73.23,63.2 40.11,30.07 20.4,30.07 v12.88,22.55
!DF_SEL_ER  (via drill 0.51)
  Top 0.254: v70.59,94.28 70.59,79.86 E1.76 | v70.59,142.44 86.23,158.09 R11.1 Q3.3 86.23,184.71 v88.06,186.54
  Bottom 0.254: v70.59,142.44 v70.59,94.28 | v88.06,186.54 88.67,186.54 92.53,190.4 Q2.3
!INT_RQST
  Top 0.254: E1.14 79.22,63.66 79.73,63.14 80.34,62.53 80.34,59.13 80.54,22.96 89.69,13.82 89.69,8.13 EDGE$3.CP1
!INTERNAL_IO
  Top 0.254: E1.19 81.76,65.63 81.76,31.09 99.24,13.61 99.24,8.13 EDGE$3.CL1
!IO_PAUSE  (via drill 0.51)
  Top 0.254: v84.2,64.21 84.2,65.63 E1.24 | v87.86,60.76 118.14,30.48 118.14,8.13 EDGE$3.CD1
  Bottom 0.254: v87.86,60.76 84.4,64.21 v84.2,64.21
!MD03  (via drill 0.51)
  Top 0.254: v85.22,77.01 85.22,77.22 86.64,77.22 E1.45 | v165.89,70.92 222.99,13.82 222.99,8.13 EDGE$3.AP1
  Bottom 0.254: v85.22,77.01 86.64,78.44 158.37,78.44 v165.89,70.92
!MD04
  Top 0.254: E1.36 86.84,72.75 87.66,72.75 87.86,72.54 105.74,72.54 105.99,72.54 108.69,69.85 109.96,69.85 165.33,14.63 165.89,14.63 165.89,8.13 EDGE$3.BK1
!MD05  (via drill 0.51)
  Top 0.254: E1.35 87.53,72.26 87.66,72.14 105.54,72.14 105.94,71.73 v108.59,69.09 | v160.2,17.48 162.64,15.04 162.64,8.13 EDGE$3.BL1
  Bottom 0.254: v160.2,17.48 v108.59,69.09
!MD06
  Top 0.254: E1.33 86.84,71.32 105.08,71.32 105.49,70.92 109.09,67.31 110.36,67.31 159.38,18.29 159.38,8.13 EDGE$3.BM1
!MD07  (via drill 0.51)
  Top 0.254: v85.22,70.51 85.22,70.71 86.64,70.71 E1.32 | v112.24,57.71 153.09,16.87 153.09,8.13 EDGE$3.BP1
  Bottom 0.254: v85.22,70.51 85.62,70.1 100.05,70.1 106.55,63.6 W2W1.1 106.55,63.4 v112.24,57.71
!MD08  (via drill 0.51)
  Top 0.254: v108.59,60.35 108.59,63.4 111.63,63.4 W4W3.1 | v83.39,56.29 v85.83,58.73 | v44.78,25.81 32.59,13.61 32.59,8.13 EDGE$3.DK1 | E1.10 77.22,64.74 76.89,64.41 76.89,61.92 77.5,61.32 v77.5,60.1
  Bottom 0.254: v108.59,60.35 106.96,58.73 v85.83,58.73 | v44.78,25.81 52.91,25.81 v83.39,56.29 77.5,56.29 v77.5,60.1
!MD09  (via drill 0.51)
  Top 0.254: v76.48,61.27 76.48,64.62 76.68,64.82 76.68,65.63 E1.9 | v44.78,31.9 29.54,16.66 29.54,8.13 EDGE$3.DL1
  Bottom 0.254: v44.78,31.9 73.79,61.21 73.84,61.27 v76.48,61.27
!MD10  (via drill 0.51)
  Top 0.254: v76.28,67.26 76.28,65.84 E1.8 | v44.78,35.76 26.29,17.27 26.29,8.13 EDGE$3.DM1
  Bottom 0.254: v44.78,35.76 v76.28,67.26
!MD11  (via drill 0.51)
  Top 0.254: v75.67,60.5 75.67,65.63 E1.7 | v35.43,29.26 19.99,13.82 19.99,8.13 EDGE$3.DP1
  Bottom 0.254: v75.67,60.5 74.19,60.5 74.04,60.35 43.15,29.26 v35.43,29.26
!POWER_OK  (via drill 0.51)
  Top 0.254: v85.62,65.63 84.81,65.63 E1.25 | v90.7,65.63 137.44,18.9 v137.44,16.87
  Bottom 0.254: v90.7,65.63 v85.62,65.63 | v137.44,16.87 137.44,8.13 EDGE$3.BV2
!RTT  (via drill 0.51)
  Top 0.254: v74.24,79.65 74.24,81.69 E1.72 | v37.26,177.19 v29.74,184.71
  Bottom 0.254: v74.24,79.65 96.39,101.8 96.39,148.95 | 96.39,148.95 96.39,149.76 R18.1 | v29.74,184.71 27.92,186.54 J1.J | v37.26,177.19 65.51,148.95 96.39,148.95
!SKIP
  Top 0.254: E1.12 78.22,64.31 78.31,62.94 79.32,61.92 79.32,17.68 83.19,13.82 83.19,8.13 EDGE$3.CS1
-1.5V
  Top 0.254: 55.96,185.32 55.96,185.52 56.97,186.54 D4.A | 55.96,185.32 55.96,177.6 56.97,176.58 D5.A | 55.96,185.32 53.31,187.96 C42.2
  Bottom 0.254: D3.C 67.13,189.18 64.69,186.74 57.17,186.74 D4.A
-3V  (via drill 0.51)
  Top 0.254: D6.C 67.34,182.88 69.57,182.88 R29.1 | v54.13,183.29 49.45,187.96 C41.2
  Bottom 0.254: v54.13,183.29 56.97,180.44 D1.A 57.17,180.44 64.69,180.44 67.13,182.88 D6.C
-4.7V
  Top 0.254: R35.2 78.51,152.4 C48.2 Q4.2
  Bottom 0.254: Q4.2 79.73,166.22 82.37,166.22 R36.1
-9V  (via drill 0.51)
  Top 0.254: R38.2 55.75,166.42 54.74,167.44 54.74,171.7 R37.1 56.36,173.33 v56.36,174.55 | Q3.2 88.88,185.52 88.88,189.18 87.66,190.4 C44.2
  Bottom 0.254: v56.36,174.55 56.97,175.16 70.79,175.16 80.95,185.32 88.67,185.32 Q3.2
-15V  (via drill 0.51)
  Top 0.254: R30.1 93.95,172.72 93.95,170.28 R31.1 93.95,170.08 93.95,163.98 R32.1 93.95,163.78 93.95,161.34 R33.1 93.95,161.14 93.95,158.9 R34.1 93.95,158.7 93.95,152.4 R35.1 | R40.1 45.59,170.08 45.59,166.42 R38.1 45.59,166.22 45.59,163.98 R39.1 45.59,163.78 45.59,24.38 v54.74,15.24 | R29.2 79.73,182.88 79.73,181.86 78.92,181.05 78.92,177.39 79.73,176.58 R41.1 79.93,176.38 v82.37,173.94
  Bottom 0.254: R40.1 45.59,170.28 49.05,173.74 77.09,173.74 79.73,176.38 R41.1 | v82.37,173.94 92.53,173.94 93.75,172.72 R30.1 | v54.74,15.24 54.74,8.13 EDGE$3.DB2
CC_DTP  (via drill 0.51)
  Top 0.254: v85.22,78.23 86.64,78.23 E1.47
  Bottom 0.254: v85.22,78.23 73.43,78.23 73.23,78.44 64.49,78.44 56.57,86.36 32.99,86.36 E08.13
CC_SETDLY  (via drill 0.51)
  Top 0.254: E1.16 80.22,64.9 80.14,64.82 80.14,63.4 81.36,62.18 v81.36,30.48 | v77.5,34.34 73.84,38 v73.84,61.98 | v81.36,77.42 82.98,79.05 v82.98,80.26 | v87.25,85.95 115.9,114.61 v115.9,165.61
  Bottom 0.254: v77.5,34.34 v81.36,30.48 | v73.84,61.98 73.84,62.79 81.76,70.71 81.76,77.42 v81.36,77.42 | v82.98,80.26 87.25,84.53 v87.25,85.95 | v115.9,165.61 129.31,179.02 130.53,179.02 E04.2
CC_T/M_EN  (via drill 0.51)
  Top 0.254: 71.4,140.61 71.4,93.47 81.76,83.11 81.76,81.89 E1.57 | 71.4,140.61 65.91,146.1 65.91,149.76 R16.1 | 71.4,140.61 v93.14,162.36
  Bottom 0.254: WTM.2 152.27,184.1 152.27,181.46 141.3,170.49 139.88,170.49 138.45,169.06 E04.11 138.25,168.86 131.75,162.36 v93.14,162.36
CC_TPG_CLK  (via drill 0.51)
  Top 0.254: E04.5 130.73,171.3 138.25,163.78 E04.9 | E1.87 69.26,74.26 v69.16,74.17 | v73.03,72.95 73.84,73.76 73.84,75.18 v77.7,79.05
  Bottom 0.254: v69.16,74.17 70.38,72.95 v73.03,72.95 | v77.7,79.05 138.25,139.6 138.25,163.78 E04.9
CC_TT_EN  (via drill 0.51)
  Top 0.254: E1.53 83.72,83.11 83.8,83.11 v84.81,83.11 | v80.54,74.78 80.14,75.18 80.14,78.44 v81.15,79.45
  Bottom 0.254: v80.54,74.78 79.93,74.78 72.01,66.85 44.78,66.85 32.99,78.64 E08.10 | v84.81,83.11 v81.15,79.45
CON_ALL_HALT  (via drill 0.51)
  Top 0.254: v47.22,120.29 47.22,89.76 68.15,68.83 68.76,68.28 70.59,68.28 E1.99
  Bottom 0.254: v47.22,120.29 47.22,129.64 29.34,147.52 29.34,150.98 27.92,150.98 J1.RR
F/!R  (via drill 0.51)
  Top 0.254: v67.74,67.67 70.59,67.67 E1.100 | v56.16,79.25 46.41,89 v46.41,119.48
  Bottom 0.254: v56.16,79.25 v67.74,67.67 | v46.41,119.48 46.41,128.63 28.93,146.1 28.93,148.54 27.92,148.54 J1.TT
GND  (via drill 0.51)
  Top 0.254: v72.21,70.31 70.79,70.31 E1.95 | 70.79,74.78 E1.86 | v73.23,83.11 73.23,81.89 E1.74 | E1.11 77.7,65.63 v77.7,62.33 78.31,61.72 78.31,15.65 80.14,13.82 80.14,8.13 EDGE$3.CT1 | v80.75,83.11 80.75,81.89 E1.59 | v88.88,67.67 86.84,67.67 E1.26 | v88.06,73.97 88.06,73.76 86.84,73.76 E1.38 | v88.06,76 88.06,76.2 86.84,76.2 E1.43 | v10.44,15.24 10.44,8.13 EDGE$3.DT1 | v23.24,15.24 23.24,8.13 EDGE$3.DN1 | v42.14,15.24 42.14,8.13 EDGE$3.DF1 | v51.69,15.24 51.69,8.13 EDGE$3.DC2 | v92.94,15.24 92.94,8.13 EDGE$3.CN1 | v112.04,15.24 112.04,8.13 EDGE$3.CF1 | v121.59,15.24 121.59,8.13 EDGE$3.CC2 | v143.74,15.24 143.74,8.13 EDGE$3.BT1 | v175.64,15.24 175.64,8.13 EDGE$3.BF2 | v184.99,15.24 184.99,8.13 EDGE$3.BC2 | v213.64,15.24 213.64,8.13 EDGE$3.AT1 | v226.44,15.24 226.44,8.13 EDGE$3.AN1 | v245.34,15.24 245.34,8.13 EDGE$3.AF1 | 70.59,74.78 E1.86 | 70.79,74.78 72.21,74.78 v72.21,74.98 | 70.79,74.78 E1.86
  Bottom 0.254: v10.44,15.24 10.44,8.13 EDGE$3.DT1 | v23.24,15.24 23.24,8.13 EDGE$3.DN1 | v42.14,15.24 42.14,8.13 EDGE$3.DF1 | v51.69,15.24 51.69,8.13 EDGE$3.DC2 | v80.34,15.24 80.34,8.13 EDGE$3.CT1 | v92.94,15.24 92.94,8.13 EDGE$3.CN1 | v112.04,15.24 112.04,8.13 EDGE$3.CF1 | v121.59,15.24 121.59,8.13 EDGE$3.CC2 | v143.74,15.24 143.74,8.13 EDGE$3.BT1 | v156.54,15.24 156.54,8.13 EDGE$3.BN2 | v175.64,15.24 175.64,8.13 EDGE$3.BF2 | v184.99,15.24 184.99,8.13 EDGE$3.BC2 | v213.64,15.24 213.64,8.13 EDGE$3.AT1 | v226.44,15.24 226.44,8.13 EDGE$3.AN1 | v245.34,15.24 245.34,8.13 EDGE$3.AF1 | v254.89,15.24 254.89,8.13 EDGE$3.AC2
  pour GND$: 0,18.41 2.41,18.41 2.41,13.97 59.56,13.97 59.56,15.88 68.77,15.88 68.77,18.41 72.26,18.41 72.26,13.97 129.41,13.97 129.41,15.88 132.27,15.88 132.27,18.41 135.76,18.41 135.76,13.97 192.91,13.97 192.91,15.88 202.12,15.88 202.12,18.41 205.61,18.41 205.61,13.97 262.76,13.97 262.76,15.88 265.3,15.88 265.3,214.63 0,214.63
IN1  (via drill 0.51)
  Top 0.254: E08.3 25.27,88.8 32.79,81.28 E08.11 | v68.56,72.54 68.76,72.75 70.59,72.75 E1.90
  Bottom 0.254: R22.2 22.84,89 25.27,89 E08.3 | v68.56,72.54 64.08,77.22 59.21,77.22 55.14,81.28 32.99,81.28 E08.11
IN2  (via drill 0.51)
  Top 0.254: E1.89 67.58,73.26 67.18,73.66 67.13,73.76 65.51,75.39 v65.51,80.06 | v56.36,85.55 v59.41,85.55
  Bottom 0.254: v65.51,80.06 60.02,85.55 v59.41,85.55 | v56.36,85.55 55.55,84.73 33.81,84.73 32.99,83.92 E08.12
IN3  (via drill 0.51)
  Top 0.254: E1.85 69.29,75.26 v69.16,75.39 | v80.95,76 86.44,81.48 86.44,83.92 125.86,123.34 125.86,169.27 130.53,173.94 E04.4
  Bottom 0.254: v69.16,75.39 69.77,76 v80.95,76
INITIALIZE
  Top 0.254: E1.13 78.72,65.63 78.72,63.4 79.88,62.23 79.98,20.27 86.44,13.82 86.44,8.13 EDGE$3.CR1
N$1  (via drill 0.61)
  other vias: 108.46,16.19
N$51
  Top 0.254: R48.2 69.57,180.44 67.34,180.44 D1.C
  Bottom 0.254: Q1.2 52.09,179.22 52.3,179.43 66.32,179.43 67.13,180.24 D1.C
N$52
  Top 0.254: R41.2 69.57,176.58 67.34,176.58 D5.C
  Bottom 0.254: Q1.1 49.45,176.38 50.27,175.56 66.32,175.56 67.13,176.38 D5.C
N$54
  Bottom 0.254: D3.A 57.17,189.38 60.83,193.04 67.13,193.04 D2.C
N$55
  Top 0.254: D10.C 58.39,169.06 58.39,171.3 D9.C
  Bottom 0.254: R40.2 55.75,170.28 56.77,171.3 58.19,171.3 D9.C
N$56
  Top 0.254: D6.A 57.17,182.88 66.12,182.88 66.12,185.52 67.13,186.54 D4.C
N$57
  Bottom 0.254: D10.A 68.56,169.06 68.76,169.27 77.7,169.27 78.51,170.08 Q5.1
N$58
  Bottom 0.254: Q3.1 89.89,182.88 78.72,171.7 68.76,171.7 68.56,171.5 D9.A
N$59  (via drill 0.51)
  Top 0.254: v72.62,175.36 72.62,168.05 68.56,163.98 D9A.A
  Bottom 0.254: v72.62,175.36 76.68,179.43 85.62,179.43 96.6,190.4 97.61,190.4 Q2.1
N$60
  Bottom 0.254: D7.A 68.56,166.22 73.84,160.93 77.7,160.93 78.51,160.12 Q4.1
N$63
  Top 0.254: R39.2 55.75,163.98 58.19,163.98 D9A.C 58.39,163.98 58.39,166.22 D7.C
N$77
  Top 0.254: E08.2 24.26,90.42 24.26,84.94 25.27,83.92 E08.5
N$78
  Top 0.254: E08.7 25.27,78.64 32.79,71.12 C37.1 32.99,71.12 32.99,67.46 R23.1
N$79
  Top 0.254: R24.1 40.51,83.92 38.07,83.92 C38.1 37.87,83.92 37.87,86.56 32.99,91.44 E08.15
N$81
  Bottom 0.254: E08.14 32.99,89 37.87,89 C38.2
N$82
  Top 0.254: E08.6 22.84,78.84 22.84,71.12 C37.2
N$94
  Top 0.254: C36.+ 144.55,170.28 140.89,173.94 140.89,179.02 R17.1
  Bottom 0.254: E04.15 138.45,179.22 140.69,179.22 R17.1
N$95
  Top 0.254: E04.14 138.45,176.58 139.88,178 139.88,185.72 144.55,190.4 C36.-
N$108
  Top 0.254: R43.1 128.29,166.42 130.53,166.42 E04.7 130.73,166.22 131.75,165.2 131.75,162.76 C39.1
N$110
  Top 0.254: C39.2 126.87,168.86 130.53,168.86 E04.6
N$111
  Top 0.254: R26.1 128.09,176.58 R43.2
N$112
  Top 0.254: E04.12 138.45,171.5 140.69,171.5 R25.2
ND0  (via drill 0.51)
  Top 0.254: v72.01,80.47 73.84,78.64 73.84,75.79 70.79,75.79 E1.84 | v25.88,126.59 26.29,127 26.29,159.72 27.71,161.14 J1.FF
  Bottom 0.254: v25.88,126.59 v72.01,80.47
ND1  (via drill 0.51)
  Top 0.254: v67.13,80.87 66.93,80.67 66.93,76.2 70.59,76.2 E1.83 | v44.78,103.23 28.93,119.08 28.93,162.76 27.92,163.78 J1.DD
  Bottom 0.254: v44.78,103.23 v67.13,80.87
ND2  (via drill 0.51)
  Top 0.254: v73.03,77.62 73.03,78.23 70.79,78.23 E1.79 | v63.88,78.03 62.05,79.86 62.05,139.4 v57.17,144.27
  Bottom 0.254: v73.03,77.62 72.62,78.03 v63.88,78.03 | v57.17,144.27 30.15,171.3 27.92,171.3 J1.X
RD00  (via drill 0.51)
  Top 0.254: R4.1 30.35,194.26 27.92,191.82 J1.D | v73.03,88.8 75.26,86.56 75.26,81.89 E1.70
  Bottom 0.254: v73.03,88.8 72.82,88.59 71.2,88.59 26.29,133.5 26.29,191.62 27.71,191.62 J1.D
RD01  (via drill 0.51)
  Top 0.254: v71.81,82.7 72.62,81.89 E1.75 | v44.78,109.73 32.59,121.92 v32.59,180.24 | R5.1 30.35,186.54 27.92,184.1 J1.L
  Bottom 0.254: v44.78,109.73 v71.81,82.7 | v32.59,180.24 28.73,184.1 27.92,184.1 J1.L
RD02  (via drill 0.51)
  Top 0.254: E1.78 69.24,78.76 68.96,79.05 v68.96,80.87 | v44.78,105.05 29.34,120.5 29.34,172.52 27.92,173.94 J1.V
  Bottom 0.254: R7.1 30.35,176.38 28.12,174.14 27.92,174.14 J1.V | v44.78,105.05 v68.96,80.87
RMT  (via drill 0.51)
  Top 0.254: v71.4,89.41 74.65,86.16 74.65,81.89 E1.71
  Bottom 0.254: R1.1 30.35,191.62 28.12,189.38 27.92,189.38 J1.F 27.71,189.18 26.7,189.18 26.7,134.11 v71.4,89.41
RUN  (via drill 0.51)
  Top 0.254: E1.28 87.94,68.76 88.27,69.09 90.3,69.09 90.7,68.68 141.3,18.09 v141.3,17.88
  Bottom 0.254: v141.3,17.88 141.3,8.13 140.69,8.13 EDGE$3.BU2
S/!G  (via drill 0.51)
  Top 0.254: v72.21,69.09 71.81,69.49 71.81,69.7 70.79,69.7 E1.96 | v69.37,70.51 68.96,70.51 68.56,70.92 67.13,72.34 64.69,74.78 64.69,75.18 v64.69,79.25 | v44.78,99.16 26.7,117.25 26.7,157.68 27.71,158.7 J1.JJ
  Bottom 0.254: v72.21,69.09 70.79,70.51 v69.37,70.51 | v44.78,99.16 v64.69,79.25
SEL_ECHO  (via drill 0.51)
  Top 0.254: R34.2 83.8,158.9 83.8,161.14 R33.2 83.8,161.34 83.8,163.78 R32.2 83.8,163.98 83.8,170.08 R31.2 83.8,170.28 83.8,172.72 | 83.8,172.72 R30.2 | R30.2 83.59,172.72 Q5.2 76.07,173.53 v72.01,177.6 | 83.8,172.72 83.8,193.04 94.97,193.04 Q2.2 | 83.8,172.72 R30.2 | v52.5,177.19 v50.27,179.43
  Bottom 0.254: v50.27,179.43 29.95,179.43 27.92,181.46 J1.N | v52.5,177.19 52.91,177.6 v72.01,177.6
T/M_ENABLE  (via drill 0.51)
  Top 0.254: E1.98 69.08,68.76 67.13,70.71 60.22,77.62 v60.22,95.5 | v44.78,110.95 33.4,122.33 v33.4,147.52
  Bottom 0.254: v44.78,110.95 v60.22,95.5 | v33.4,147.52 27.92,153.01 27.92,153.62 J1.NN
T_CPLD  (via drill 0.51)
  Top 0.254: v72.21,79.25 70.79,79.25 E1.77 | v69.77,81.69 67.95,83.52 67.95,143.46 50.47,160.93 50.47,178.21 49.45,179.22 49.45,181.46 Q1.3
  Bottom 0.254: v69.77,81.69 v72.21,79.25 | R27.1 79.73,186.54 77.29,184.1 51.89,184.1 49.45,181.66 Q1.3
TCK  (via drill 0.51)
  Top 0.254: E1.62 79.22,83.02 79.12,83.11 78.72,83.52 v78.72,85.14 | v78.72,87.17 84.81,93.27 84.81,142.04 95.38,152.6 v95.38,190.81
  Bottom 0.254: v78.72,87.17 v78.72,85.14 | v95.38,190.81 98.83,194.26 98.83,200.56 ISP.1
TDI  (via drill 0.51)
  Top 0.254: v79.93,80.26 74.24,74.57 74.24,65.84 E1.4 | v86.03,86.36 108.99,109.32 108.99,200.56 ISP.9
  Bottom 0.254: v86.03,86.36 v79.93,80.26
TDO  (via drill 0.51)
  Top 0.254: E1.73 73.72,82.58 74.04,82.91 74.04,83.92 v73.84,84.12 | v73.84,144.07 92.94,163.17 92.94,189.38 101.47,197.92 101.47,200.56 ISP.3
  Bottom 0.254: v73.84,144.07 v73.84,84.12
TMS  (via drill 0.51)
  Top 0.254: v79.73,79.05 79.73,65.84 E1.15 | v85.06,84.38 85.22,84.53 85.22,137.36 103.91,156.06 103.91,200.56 ISP.5
  Bottom 0.254: v85.06,84.38 v79.73,79.05
TP3  (via drill 0.51)
  Top 0.254: v109.4,30.28 109.4,32.31 87.05,54.66 87.05,66.85 82.98,66.85 82.78,66.65 82.78,65.84 E1.21
  Bottom 0.254: v109.4,30.28 109.4,8.13 108.79,8.13 EDGE$3.CH2
TP4  (via drill 0.51)
  Top 0.254: v82.17,67.26 82.17,65.84 E1.20 | v84.2,62.99 86.64,60.55 v86.64,52.63
  Bottom 0.254: v82.17,67.26 82.17,62.99 v84.2,62.99 | v86.64,52.63 105.54,33.73 105.54,8.13 EDGE$3.CJ2
UNITH  (via drill 0.51)
  Top 0.254: E1.97 70.41,69.26 70.38,69.29 69.37,69.29 67.34,71.32 61.24,77.42 v61.24,92.25 | v43.56,109.93 31.57,121.92 v31.57,152.4
  Bottom 0.254: v43.56,109.93 v61.24,92.25 | v31.57,152.4 27.92,156.06 J1.LL
VCC  (via drill 0.51)
  Top 0.254: 70.59,73.76 E1.88 70.79,73.76 71.81,73.76 | v80.95,64.41 81.15,64.62 81.15,65.63 E1.18 | v72.21,76.81 70.79,76.81 E1.82 | E1.34 86.64,71.73 v85.22,71.73 85.22,74.17 85.31,74.26 E1.39 | v85.62,81.69 84.81,81.69 E1.51 | E1.3 73.72,67.13 73.53,67.31 v73.43,67.26 | 71.81,73.76 v72.21,73.76 71.81,73.76 | E1.91 71.81,72.26 71.81,72.34 71.81,73.76 | E1.66 77.22,84.96 C2.1
  Bottom 0.254: v80.95,64.41 80.95,58.32 83.39,58.32 127.69,14.02 127.69,8.13 EDGE$3.CA2 | v191.49,15.24 191.49,8.13 EDGE$3.BA2 | v261.19,15.24 261.19,8.13 EDGE$3.AA2
  pour VCC$: 0,18.41 2.41,18.41 2.41,13.97 59.56,13.97 59.56,15.88 68.77,15.88 68.77,18.41 72.26,18.41 72.26,13.97 129.41,13.97 129.41,15.88 132.27,15.88 132.27,18.41 135.76,18.41 135.76,13.97 192.91,13.97 192.91,15.88 202.12,15.88 202.12,18.41 205.61,18.41 205.61,13.97 262.76,13.97 262.76,15.88 265.3,15.88 265.3,214.63 0,214.63
W2  (via drill 0.51)
  Top 0.254: v87.25,81.69 84.4,78.84 84.4,77.22 80.75,73.56 80.75,65.84 E1.17
  Bottom 0.254: v87.25,81.69 89.28,83.72 106.55,83.72 W2W1.3
W2W1  (via drill 0.51)
  Top 0.254: v91.11,77.62 91.11,77.83 86.84,77.83 E1.46
  Bottom 0.254: v91.11,77.62 91.72,77.01 103.3,77.01 106.55,73.76 W2W1.2
W3  (via drill 0.51)
  Top 0.254: v84.2,80.26 84.2,81.69 E1.52 | v97.61,80.87 111.63,80.87 111.63,83.72 W4W3.3
  Bottom 0.254: v84.2,80.26 84.81,80.87 v97.61,80.87
W4W3
  Top 0.254: E1.48 88.19,78.76 88.47,79.05 111.63,79.05 111.63,73.76 W4W3.2
WD_ENAB  (via drill 0.51)
  Top 0.254: v67.13,95.5 67.13,83.72 67.95,82.91 67.95,80.87 68.56,80.26 68.56,77.83 70.59,77.83 E1.80 | v44.78,117.86 43.97,118.67 v43.97,153.01
  Bottom 0.254: v44.78,117.86 v67.13,95.5 | v43.97,153.01 28.12,168.86 27.92,168.86 J1.Z
WPT  (via drill 0.51)
  Top 0.254: v67.74,79.25 67.74,77.22 70.59,77.22 E1.81 | v43.97,106.88 30.15,120.7 v30.15,155.45
  Bottom 0.254: v67.74,79.25 43.97,103.02 v43.97,106.88 | v30.15,155.45 30.15,166.22 27.92,166.22 J1.BB
WRT_ECHO  (via drill 0.51)
  Top 0.254: 76.07,184.1 v78.51,181.66 | 76.07,184.1 76.07,190.4 C47.1 | 76.07,184.1 v72.42,180.44
  Bottom 0.254: v78.51,181.66 79.73,180.44 R48.1 | v72.42,180.44 69.98,178 29.34,178 27.92,176.58 J1.T

### Text on the board
Top: OFF | WTM | + | W1 | W3 | W2 | W4 | SIDE 1 | + | + | +
Bottom: TAPE | DEC | CONTROL M868H | SIMPLE | SIDE 2